# Altium project bch-stmnode_v0.2.PrjPcb (part 1 of 2)
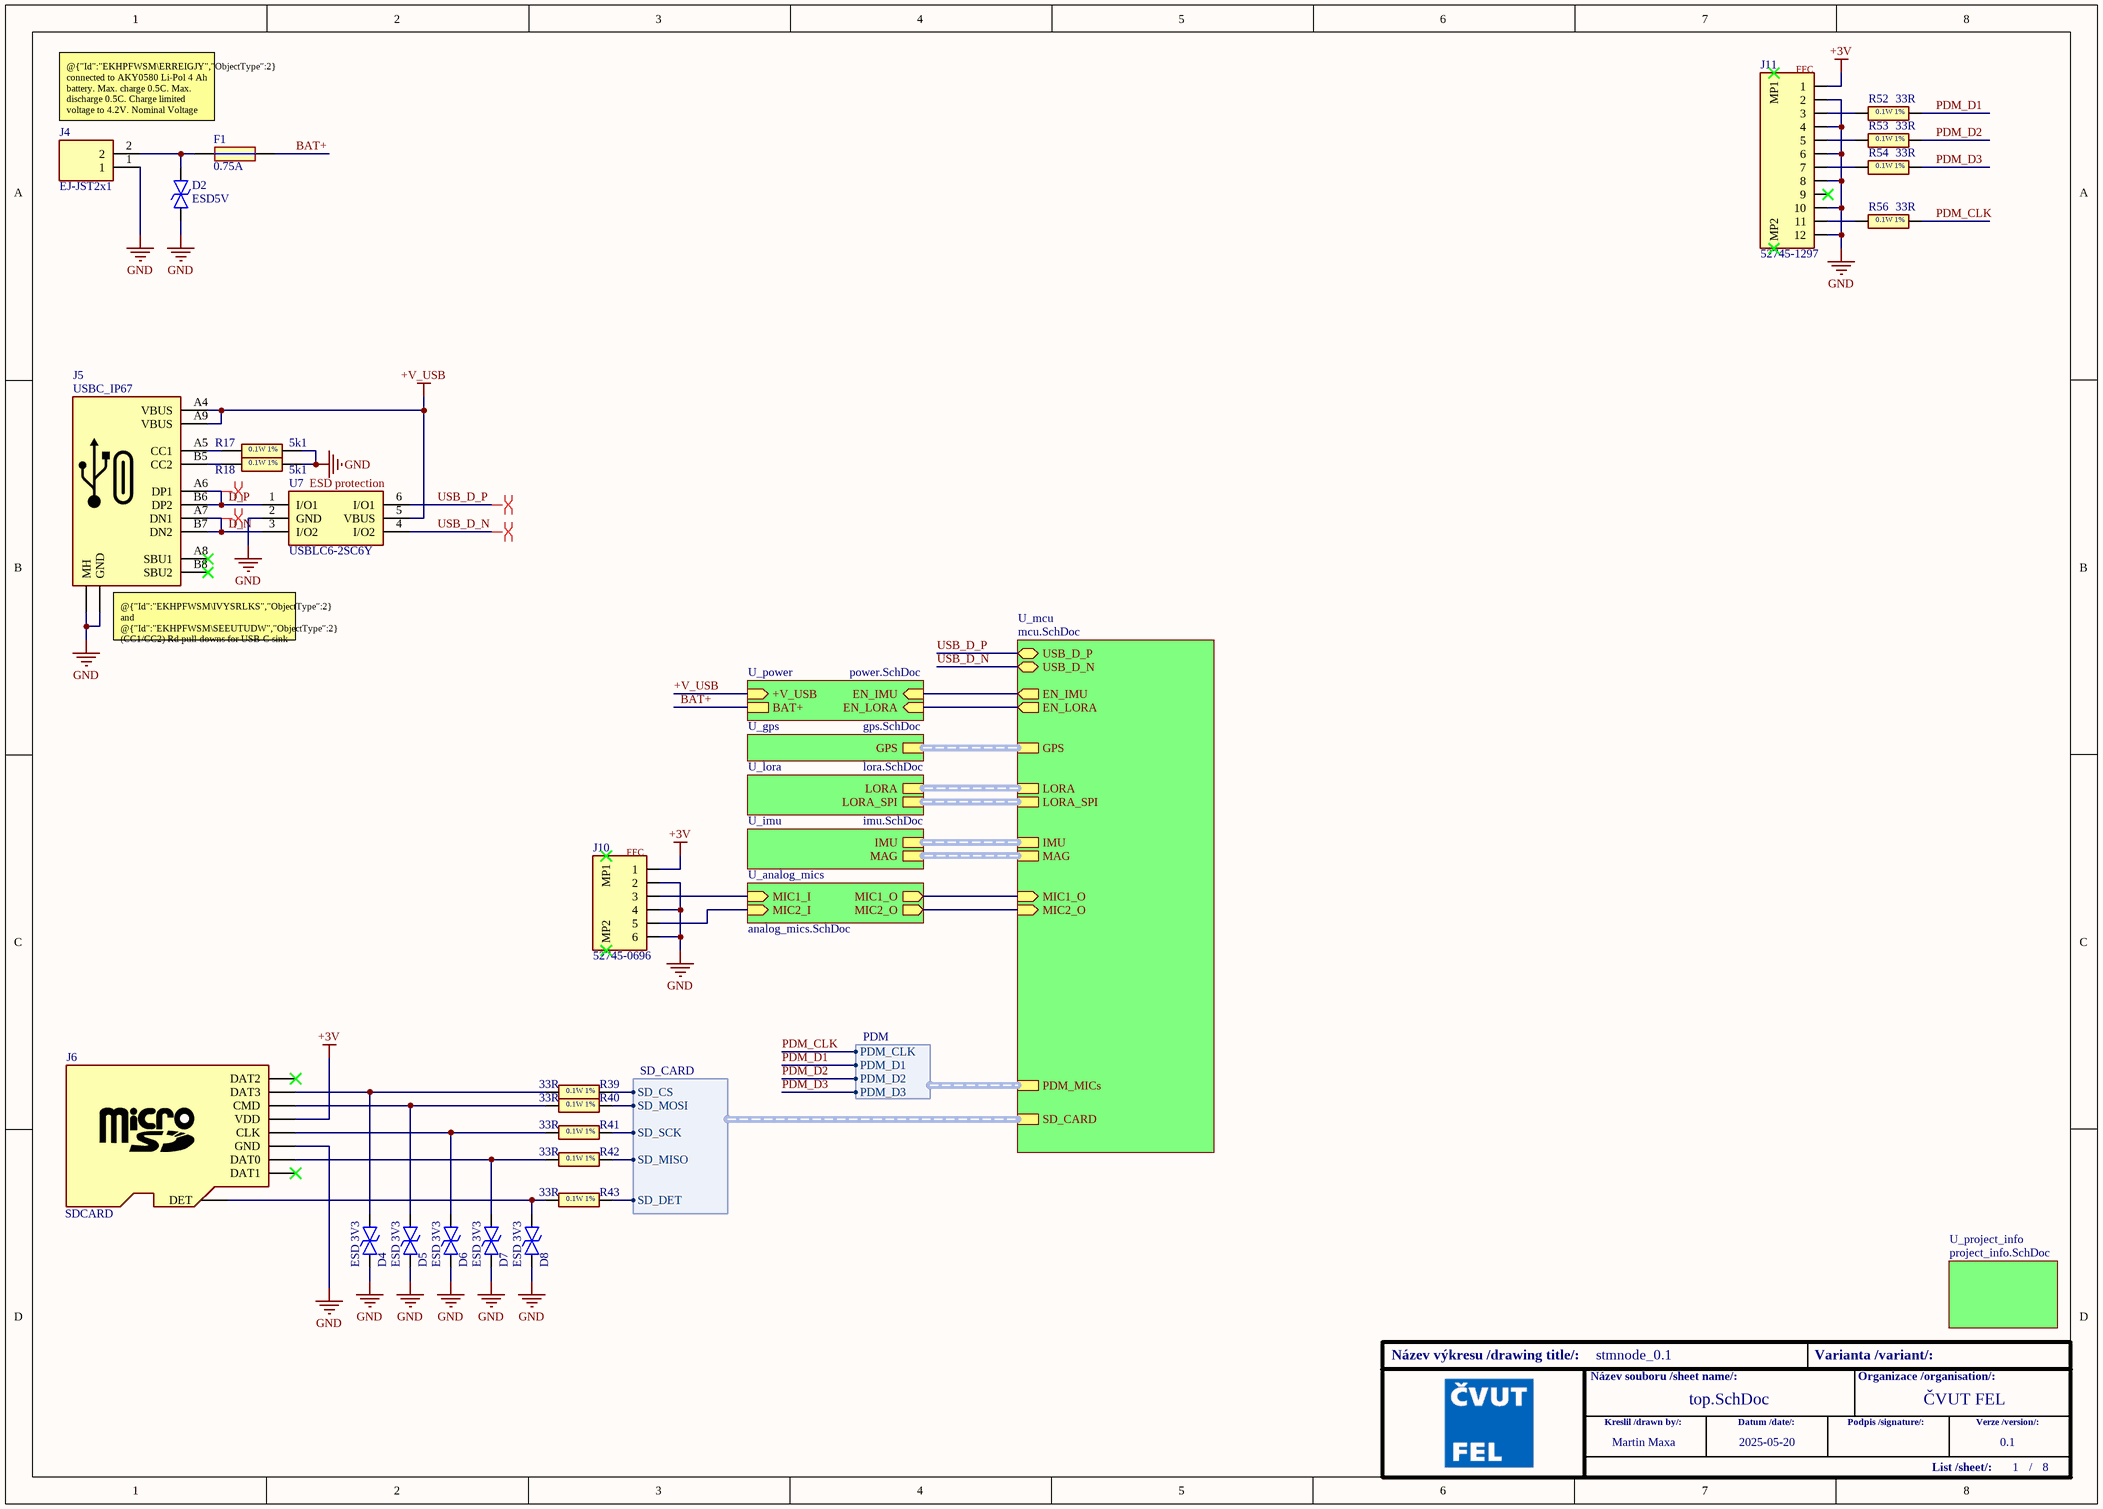
[diagram p0: top.SchDoc]
Author: Martin Maxa; Date: 2025-05-20; Name: stmnode; Project: boomchecker; Revision: 0.1
7 sheets, 140 parts. Net scope: hierarchical (ports join the sheet entries above them; power ports are global).
Board file: bch-stmnode_v0.2.PcbDoc
Sheets:
  top.SchDoc
    U_gps = gps.SchDoc
    U_lora = lora.SchDoc
    U_power = power.SchDoc
    U_mcu = mcu.SchDoc
    U_imu = imu.SchDoc
    U_project_info = project_info.SchDoc

## Sheet top.SchDoc
size A3; SheetNumber: 1; SheetTotal: 8

### Parts
D2  ESD5V  [SODFL1006X40N]
D4  ESD 3V3  [SODFL1006X40N]
D5  ESD 3V3  [SODFL1006X40N]
D6  ESD 3V3  [SODFL1006X40N]
D7  ESD 3V3  [SODFL1006X40N]
D8  ESD 3V3  [SODFL1006X40N]
F1  0.75A  [PTS120630V012]
J4  EJ-JST2x1  [S2BZRLFSN]
J5  USBC_IP67  [USB472003A]
J6  SDCARD  [1051620001]
J10  52745-0696  [527450696]
J11  52745-1297  [527451297]
R17  5k1  [RESC1608X55N]
R18  5k1  [RESC1608X55N]
R39  33R  [RESC1608X55N]
R40  33R  [RESC1608X55N]
R41  33R  [RESC1608X55N]
R42  33R  [RESC1608X55N]
R43  33R  [RESC1608X55N]
R52  33R  [RESC1608X55N]
R53  33R  [RESC1608X55N]
R54  33R  [RESC1608X55N]
R56  33R  [RESC1608X55N]
U7  USBLC6-2SC6Y  [SOT95P280X145-6N]

### Sub-sheets
U_analog_mics = analog_mics.SchDoc (file not in this document): MIC1_I (in), MIC2_I (in), MIC1_O (out), MIC2_O (out)
U_gps = gps.SchDoc: GPS (harness GPS)
U_imu = imu.SchDoc: MAG (harness MAG), IMU (harness IMU)
U_lora = lora.SchDoc: LORA_SPI (harness SPI), LORA (harness EBYTE22)
U_mcu = mcu.SchDoc: SD_CARD (harness SD_CARD), PDM_MICs (harness PDM), USB_D_P (bidir), USB_D_N (bidir), EN_IMU (out), EN_LORA (out), GPS (harness GPS), LORA (harness EBYTE22), LORA_SPI (harness SPI), IMU (harness IMU), MAG (harness MAG), MIC1_O (in), MIC2_O (in)
U_power = power.SchDoc: BAT+, EN_LORA (in), EN_IMU (in), +V_USB (in)
U_project_info = project_info.SchDoc: no entries

### Harnesses
SD_CARD: SD_CS, SD_MOSI, SD_SCK, SD_MISO, SD_DET
PDM: PDM_D3, PDM_D2, PDM_D1, PDM_CLK

### Nets
+3V: J6.4(VDD) J10.1 J11.1
+V_USB: J5.A4(VBUS) J5.A9(VBUS) U7.5(VBUS) ; sheet U_power/+V_USB
GND: D2.1 D4.1 D5.1 D6.1 D7.1 D8.1 J4.1 J5.A12(GND) J5.MH1(MH) J6.10(GND) J10.2 J10.4 J10.6 J11.2 J11.4 J11.6 J11.8 J11.10 J11.12 R17.2 R18.2 U7.2(GND)
BAT+: F1.2 ; sheet U_power/BAT+
D_N: J5.A7(DN1) J5.B7(DN2) U7.3(I/O2)  [project net D_N_1]
D_P: J5.A6(DP1) J5.B6(DP2) U7.1(I/O1)  [project net D_P_1]
PDM_CLK: R56.2 ; sheet U_mcu/PDM_MICs.PDM_CLK
PDM_D1: R52.2 ; sheet U_mcu/PDM_MICs.PDM_D1
PDM_D2: R53.2 ; sheet U_mcu/PDM_MICs.PDM_D2
PDM_D3: R54.2 ; sheet U_mcu/PDM_MICs.PDM_D3
SD_CS: R39.2 ; sheet U_mcu/SD_CARD.SD_CS
SD_DET: R43.2 ; sheet U_mcu/SD_CARD.SD_DET
SD_MISO: R42.2 ; sheet U_mcu/SD_CARD.SD_MISO
SD_MOSI: R40.2 ; sheet U_mcu/SD_CARD.SD_MOSI
SD_SCK: R41.2 ; sheet U_mcu/SD_CARD.SD_SCK
USB_D_N: U7.4(I/O2) ; sheet U_mcu/USB_D_N
USB_D_P: U7.6(I/O1) ; sheet U_mcu/USB_D_P
NetD2_2: D2.2 F1.1 J4.2
NetD4_2: D4.2 J6.2(DAT3) R39.1
NetD5_2: D5.2 J6.3(CMD) R40.1
NetD6_2: D6.2 J6.5(CLK) R41.1
NetD7_2: D7.2 J6.7(DAT0) R42.1
NetD8_2: D8.2 J6.9(DET) R43.1
NetJ5_A5: J5.A5(CC1) R17.1
NetJ5_B5: J5.B5(CC2) R18.1
NetJ10_3: J10.3 ; sheet U_analog_mics/MIC1_I
NetJ10_5: J10.5 ; sheet U_analog_mics/MIC2_I
NetJ11_3: J11.3 R52.1
NetJ11_5: J11.5 R53.1
NetJ11_7: J11.7 R54.1
NetJ11_11: J11.11 R56.1
NetU4_34: sheet U_mcu/MIC1_O, sheet U_analog_mics/MIC1_O
NetU4_35: sheet U_mcu/MIC2_O, sheet U_analog_mics/MIC2_O
NetU4_58: sheet U_power/EN_LORA, sheet U_mcu/EN_LORA
NetU4_128: sheet U_power/EN_IMU, sheet U_mcu/EN_IMU

Not connected (* = marked no-connect by the designer): J5 A8(SBU1)* B8(SBU2)*; J6 1(DAT2)* 8(DAT1)*; J10 7(MP1)* 8(MP2)*; J11 9* MP1* MP2*

### Buses and harness runs
harness sheet U_gps/GPS = sheet U_mcu/GPS
harness sheet U_imu/IMU = sheet U_mcu/IMU
harness sheet U_imu/MAG = sheet U_mcu/MAG
harness sheet U_lora/LORA = sheet U_mcu/LORA
harness sheet U_lora/LORA_SPI = sheet U_mcu/LORA_SPI

### Layout directives
differential pair; differential pair class USB: D_N_1, D_P_1, USB_D_N, USB_D_P

### Notes on the sheet
- (near J11) FFC
- @{"Id":"EKHPFWSM\ERREIGJY","ObjectType":2} connected to AKY0580 Li-Pol 4 Ah battery. Max. charge 0.5C. Max. discharge 0.5C. Charge limited voltage to 4.2V. Nominal Voltage 3.7V.
- (near U7) ESD protection
- (near J5) @{"Id":"EKHPFWSM\IVYSRLKS","ObjectType":2} and @{"Id":"EKHPFWSM\SEEUTUDW","ObjectType":2} (CC1/CC2) Rd pull-downs for USB-C sink detection. USB2.0 = 500mA; USB3.x = 900mA.
- (near J10) FFC
- Název výkresu /drawing title/:
- Název souboru /sheet name/:
- Varianta /variant/:
- Organizace /organisation/:
- ČVUT FEL
- Kreslil /drawn by/:
- Datum /date/:
- Podpis /signature/:
- List /sheet/:
- Verze /version/:
- /
- (in symbol ER+5k1) 0.1W 1%
- (in symbol ER+33R) 0.1W 1%

### Library data of the parts
D2 = ED+ESD5V: ESD Protection Diode, Bidirectional, VRWM=5 V, VBR=6 V typ., VC=14 V max, IPP=6 A, Cd=20 pF, ±30 kV ESD, SOD-923; Manufacturer_Name: Diodes Incorporated; Manufacturer_Part_Number: D5V0L1B2S9-7; Datasheet Link: https://www.diodes.com/assets/Datasheets/D5V0L1B2S9.pdf; Height: 0.4mm; Mouser Part Number: 621-D5V0L1B2S9-7; Mouser Price/Stock: https://www.mouser.co.uk/ProductDetail/Diodes-Incorporated/D5V0L1B2S9-7?qs=bLNvM6dkO6SRwc%2Fzm27P2g%3D%3D; Arrow Part Number: D5V0L1B2S9-7; Arrow Price/Stock: https://www.arrow.com/en/products/d5v0l1b2s9-7/diodes-incorporated?utm_currency=USD&region=nac
D4-D8 = ED+ESD3.3V15pF: Vesd (ESD contact/air gap): 18 kV, Cd (Diode Capacitance): 15 pF, Working Voltage: 3.3 V, Breakdown Voltage: 5 V, Clamping Voltage: 10.5 V; Manufacturer_Name: onsemi; Manufacturer_Part_Number: ESD9B3.3ST5G; Datasheet Link: https://www.onsemi.com/pub/Collateral/ESD9B-D.PDF; Height: 0.4mm; Mouser Part Number: 863-ESD9B3.3ST5G; Mouser Price/Stock: https://www.mouser.co.uk/ProductDetail/onsemi/ESD9B3.3ST5G?qs=yU2N9dt%252BrfmXrPf3vhgUEA%3D%3D; Arrow Part Number: ESD9B3.3ST5G; Arrow Price/Stock: https://www.arrow.com/en/products/esd9b3.3st5g/on-semiconductor?utm_currency=USD&region=nac
F1 = EF+0.75A6V_1206: Resettable Fuses - PPTC 1206 6V 0.75A 1.1W SMD AEC-Q200 High Temp; Manufacturer_Name: YAGEO; Manufacturer_Part_Number: SMDH1206B075TF; Datasheet Link: https://cz.mouser.com/datasheet/3/508/1/smdh1206.pdf; Mouser Part Number: 603-SMDH1206B075TF; Mouser Price/Stock: https://cz.mouser.com/ProductDetail/YAGEO/SMDH1206B075TF?qs=jcD%2FCkGBYeN0SVo4GFcQbQ%3D%3D
J4 = EJ-JST2x1: Konektor: kabel-pl.spoj; zásuvka; vidlice; PIN: 2; PH; 2A; 100V; SMT; Manufacturer_Name: JST (JAPAN SOLDERLESS TERMINALS); Manufacturer_Part_Number: S2B-ZR (LF)(SN); Datasheet Link: https://www.jst-mfg.com/product/pdf/eng/eZH.pdf?6794690f4fd86; Height: 3.7mm; Arrow Part Number: S2B-ZR (LF)(SN); Arrow Price/Stock: https://www.arrow.com/en/products/s2b-zr-lf-sn/jst-manufacturing?region=europe
J5 = EJ-USBC_IP67: USB Connectors USB2.0 TypeC Recpt., 3u Gold, 16P Horz Mid Mount SMT, 1.13mm O-set, IP67; pin to pad: A1, A12>A12+A1 A12>A12+A1 MH>MH1+MH2+MH3+MH4+MH5+MH6; Manufacturer_Name: GCT (GLOBAL CONNECTOR TECHNOLOGY); Manufacturer_Part_Number: USB4720-03-A; Datasheet Link: https://www.gct.co/files/drawings/USB4720.pdf; Height: 3.9mm; Mouser Part Number: 640-USB472003A; Mouser Price/Stock: https://www.mouser.co.uk/ProductDetail/GCT/USB4720-03-A?qs=Z%252BL2brAPG1IK%252BbxHmYg8zQ%3D%3D
J6 = EMECH+SDCARD: Memory Card Connectors Micro SD Push Pull SMT 1.15mm; pin to pad: 10>6+10+11+12+13; Manufacturer_Name: Molex; Manufacturer_Part_Number: 105162-0001; Datasheet Link: http://www.molex.com/webdocs/datasheets/pdf/en-us//1051620001_MEMORY_CARD_SOCKET.pdf; Height: 1.45mm; Mouser Part Number: 538-105162-0001; Mouser Price/Stock: https://www.mouser.co.uk/ProductDetail/Molex/105162-0001?qs=1fNsfHe5VsK8daqlgKxZfQ%3D%3D
J10 = EJ+52745-0696: FFC & FPC Connectors RA SMT ZIF TOP 6P ROHS COMPLIANT, Pitch: 0.5 mm, Mounting Angle / Contact Location: Right Angle / Top Contact, Current Rating: 500 mA, Voltage Rating: 50 V; Manufacturer_Name: Molex; Datasheet Link: https://www.molex.com/content/dam/molex/molex-dot-com/products/automated/en-us/salesdrawingpdf/527/52745/527450696_sd.pdf?inline; Height: 2.2mm; Manufacturer_Part_Number: 52745-0696; Mouser Part Number: 538-52745-0696; Mouser Price/Stock: https://www.mouser.co.uk/ProductDetail/Molex/52745-0696?qs=AU9XQWArEY9ei7I32bfdLw%3D%3D
J11 = EJ+52745-1297: FFC & FPC Connectors RA SMT ZIF TOP 12P GOLD, Pitch: 0.5 mm, Mounting Angle / Contact Location: Right Angle / Top Contact, Current Rating: 500 mA, Voltage Rating: 50 V; Manufacturer_Name: Molex; Datasheet Link: https://www.molex.com/pdm_docs/sd/527451297_sd.pdf; Height: 2mm; Manufacturer_Part_Number: 52745-1297; Mouser Part Number: 538-52745-1297; Mouser Price/Stock: https://www.mouser.co.uk/ProductDetail/Molex/52745-1297?qs=nDwhpid8gJaCgIkitRUygg%3D%3D
R17 R18 = ER+5k1: Thick Film Resistors - SMD 1/10Watt 5.1Kohms 1%; Manufacturer_Name: Vishay; Manufacturer_Part_Number: CRCW06035K10FKEBC; Datasheet Link: https://www.vishay.com/docs/28773/crcwce3.pdf; Height: 0.55mm; Mouser Part Number: 71-CRCW06035K10FKEBC; Mouser Price/Stock: https://www.mouser.co.uk/ProductDetail/Vishay-Dale/CRCW06035K10FKEBC?qs=wd5RIQLrsJiajonkePuzqw%3D%3D; Arrow Part Number: CRCW06035K10FKEBC; Arrow Price/Stock: https://www.arrow.com/en/products/crcw06035k10fkebc/vishay?region=nac
R39-R43 R52-R54 R56 = ER+33R: Resistor 1% 0.1W; Manufacturer_Name: ROYALOHM; Manufacturer_Part_Number: 0603WAF330JT5E; Datasheet Link: https://datasheet.lcsc.com/lcsc/2206010116_UNI-ROYAL-Uniroyal-Elec-0603WAF330JT5E_C23140.pdf; Height: 0.55mm; Mouser Part Number: 303-0603WAF330JT5E; Mouser Price/Stock: https://www.mouser.co.uk/ProductDetail/Royalohm/0603WAF330JT5E?qs=e8oIoAS2J1RitKiKgULsBA%3D%3D
U7 = EU+ESDUSBLC6: Low Cap. ESD Protection Auto SOT-23-6 STMicroelectronics USBLC6-2SC6Y, Dual Uni-Directional TVS Diode Array, 6-Pin SOT-23; Geometry.Height: 1.45mm; Manufacturer_Name: STMicroelectronics; Manufacturer_Part_Number: USBLC6-2SC6Y; Mouser Part Number: 511-USBLC6-2SC6Y; Mouser Price/Stock: https://www.mouser.co.uk/ProductDetail/STMicroelectronics/USBLC6-2SC6Y?qs=gNDSiZmRJS%2FOgDexvXkdow%3D%3D; Arrow Part Number: USBLC6-2SC6Y; Arrow Price/Stock: https://www.arrow.com/en/products/usblc6-2sc6y/stmicroelectronics.html?utm_currency=USD&region=nac; Datasheet Link: https://www.st.com/resource/en/datasheet/usblc6-2sc6y.pdf

## Sheet gps.SchDoc
size A4; SheetNumber: 2; SheetTotal: 6
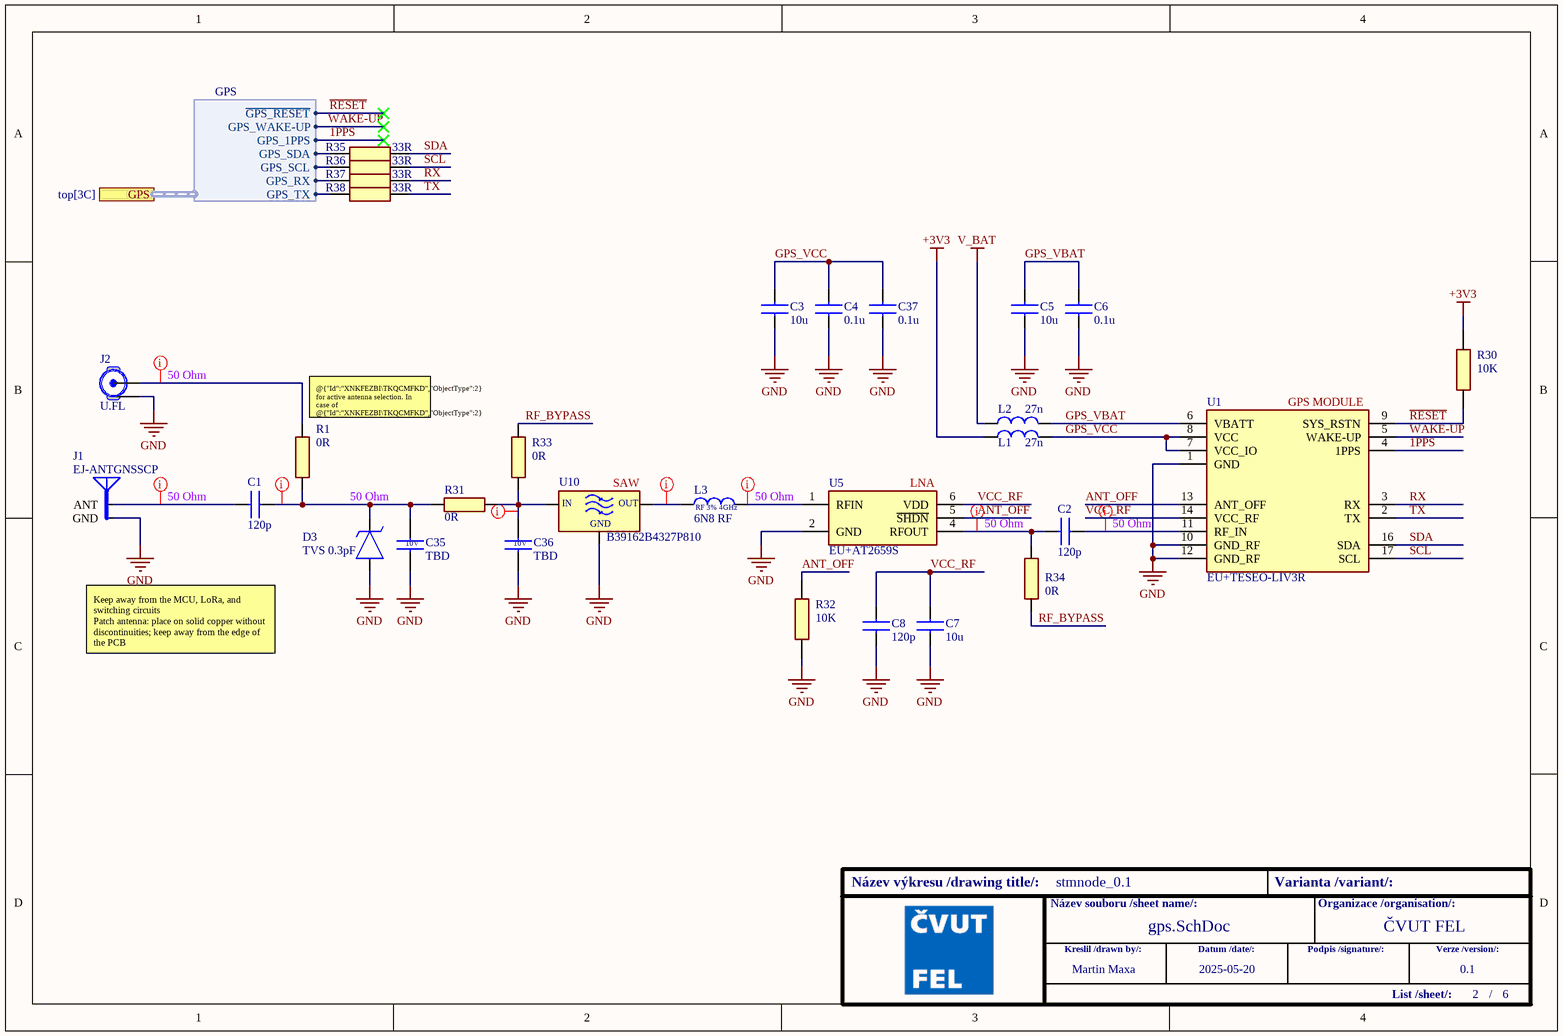
[diagram p1: gps.SchDoc]

### Parts
(Parts that share a designator on the sheet are numbered #1, #2 ... from top to bottom, then left to right.)
C1  120p  [CAPC1005X55N]
C2  120p  [CAPC1005X55N]
C3  10u  [C0603]
C4  0.1u  [CAPC1608X95N]
C5#1  10u  [C0603]
C6  0.1u  [CAPC1608X95N]
C7  10u  [C0603]
C8  120p  [CAPC1005X55N]
C35  TBD  [CAPC1608X97N]
C36  TBD  [CAPC1608X97N]
C37#1  0.1u  [CAPC1608X95N]
D3  TVS 0.3pF  [SP320501ETG]
J1  EJ-ANTGNSSCP  [ANTGNSSCPTH18L1]
J2  U.FL  [CONUFL001SMDT]
L1  27n  [LQG15WH0N7B02D]
L2  27n  [LQG15WH0N7B02D]
L3  6N8 RF  [LQW15CNR20J00B]
R1  0R  [RESC1005X37N]
R30  10K  [RESC1608X50N]
R31  0R  [RESC1005X37N]
R32  10K  [RESC1608X50N]
R33  0R  [RESC1005X37N]
R34  0R  [RESC1005X37N]
R35  33R  [RESC1608X55N]
R36  33R  [RESC1608X55N]
R37  33R  [RESC1608X55N]
R38  33R  [RESC1608X55N]
U1  EU+TESEO-LIV3R  [TESEOLIV3R]
U5  EU+AT2659S  [SOT95P280X125-6N]
U10  B39162B4327P810  [B39162B4327P810]

### Ports
GPS (harness GPS, see top[3C])

### Harnesses
GPS: GPS_TX, GPS_RX, GPS_SCL, GPS_SDA, GPS_1PPS, GPS_WAKE-UP, ~{GPS_RESET}

### Nets
+3V3: L1.23 R30.2
GND: C3.1 C4.1 C5#1.1 C6.1 C7.1 C8.1 C35.2 C36.2 C37#1.1 D3.2(A) J1.2(GND) J2.2(GND) R32.1 U1.1(GND) U1.10(GND_RF) U1.12(GND_RF) U5.2(GND) U10.2
V_BAT: L2.23
1PPS: U1.4(1PPS) ; port GPS.GPS_1PPS
ANT_OFF: R32.2 U1.13(ANT_OFF) U5.5(~{SHDN})  [project net ANT_OFF_2]
GPS_RX: R37.1 ; port GPS.GPS_RX
GPS_SCL: R36.1 ; port GPS.GPS_SCL
GPS_SDA: R35.1 ; port GPS.GPS_SDA
GPS_TX: R38.1 ; port GPS.GPS_TX
GPS_VBAT: C5#1.2 C6.2 L2.24 U1.6(VBATT)  [project net GPS_VBAT_2]
GPS_VCC: C3.2 C4.2 C37#1.2 L1.24 U1.7(VCC_IO) U1.8(VCC)  [project net GPS_VCC_2]
~{RESET}: R30.1 U1.9(SYS_RSTN) ; port GPS.~{GPS_RESET}  [project net ~{GPS_RESET}]
RF_BYPASS: R33.2 R34.1  [project net RF_BYPASS_2]
RX: R37.2 U1.3(RX)  [project net RX_2]
SCL: R36.2 U1.17(SCL)  [project net SCL_2]
SDA: R35.2 U1.16(SDA)  [project net SDA_2]
TX: R38.2 U1.2(TX)  [project net TX_2]
VCC_RF: C7.2 C8.2 U1.14(VCC_RF) U5.6(VDD)  [project net VCC_RF_2]
WAKE-UP: U1.5(WAKE-UP) ; port GPS.GPS_WAKE-UP  [project net GPS_WAKE-UP]
NetC1_1: C1.1 J1.1(ANT)
NetC1_2: C1.2 C35.1 D3.1(K) R1.1 R31.1
NetC2_1: C2.1 R34.2 U5.4(RFOUT)
NetC2_2: C2.2 U1.11(RF_IN)
NetC36_1: C36.1 R31.2 R33.1 U10.1(IN)
NetJ2_1: J2.1(SIG) R1.2
NetL3_23: L3.23 U10.4(OUT)
NetL3_24: L3.24 U5.1(RFIN)

### Layout directives
net class 50R_RF: NetC1_1, NetC1_2, NetC2_1, NetC2_2, NetC36_1, NetJ2_1, NetL3_23, NetL3_24

### Notes on the sheet
- 50 Ohm
- (near R1) @{"Id":"XNKFEZBI\TKQCMFKD","ObjectType":2} for active antenna selection. In case of @{"Id":"XNKFEZBI\TKQCMFKD","ObjectType":2} placed leave @{"Id":"XNKFEZBI\TFZHEKEL","ObjectType":2} unpopulated.
- (near U1) GPS MODULE
- (near U10) SAW
- (near L3) 50 Ohm
- (near U5) LNA
- Keep away from the MCU, LoRa, and switching circuits
  Patch antenna: place on solid copper without discontinuities; keep away from the edge of the PCB
- Název výkresu /drawing title/:
- Název souboru /sheet name/:
- Varianta /variant/:
- Organizace /organisation/:
- ČVUT FEL
- Kreslil /drawn by/:
- Datum /date/:
- Podpis /signature/:
- List /sheet/:
- Verze /version/:
- /
- (in symbol ECK+12p10V) 10V
- (in symbol EL+6N8RF_0402) RF 3% 4GHz
- (in symbol EU+GNSSSAW) GND
- (in symbol ECK+10u10V) 10V
- (in symbol ECK+100n16V) 16V
- (in symbol ER+10K) 0.1W 1%

### Library data of the parts
C1 C2 C8 = ECK+120p_50V_0402: Multilayer Ceramic Capacitors MLCC - SMD/SMT 120 pF 50 VDC 5% 0402 C0G (NP0) AEC-Q200; Manufacturer_Name: Murata Electronics; Manufacturer_Part_Number: GCM1555C1H121JA16J; Datasheet Link: https://search.murata.co.jp/Ceramy/image/img/A01X/G101/ENG/GCM1555C1H121JA16-01A.pdf; Height: 0.55mm; Mouser Part Number: 81-GCM1555C1H121JA6J; Mouser Price/Stock: https://www.mouser.co.uk/ProductDetail/Murata-Electronics/GCM1555C1H121JA16J?qs=bGEzvQhTDnbTpDR%252B7iTnIA%3D%3D; Arrow Part Number: GCM1555C1H121JA16J; Arrow Price/Stock: https://www.arrow.com/en/products/gcm1555c1h121ja16j/murata-manufacturing?region=nac
C3 C5#1 C7 = ECK+10u10V: 10 VDC, 20 %, X5R; Manufacturer_Name: KEMET; Manufacturer_Part_Number: C0603C106M8PACTU; Datasheet Link: https://content.kemet.com/datasheets/KEM_C1006_X5R_SMD.pdf; Height: 0.87mm; Mouser Part Number: 80-C0603C106M8PACTU; Mouser Price/Stock: https://www.mouser.co.uk/ProductDetail/KEMET/C0603C106M8PACTU?qs=gt1LBUVyoHk6B7S%252BOYJa0A%3D%3D; Arrow Part Number: C0603C106M8PACTU; Arrow Price/Stock: https://www.arrow.com/en/products/c0603c106m8pactu/kemet-corporation?region=nac
C4 C6 C37#1 = ECK+100n16V: 16V 0.1uF XR7 0603 10%; Manufacturer_Name: KEMET; Manufacturer_Part_Number: C0603C104K4RAC-TU; Datasheet Link: https://connect.kemet.com:7667/gateway/IntelliData-ComponentDocumentation/1.0/download/specsheet/C0603C104K4RACTU; Height: 0.95mm; Mouser Part Number: 80-C0603C104K4RAC; Arrow Part Number: C0603C104K4RAC-TU; Arrow Price/Stock: https://www.arrow.com/en/products/c0603c104k4ractu/kemet-corporation
C35 C36 = ECK+12p10V: Multilayer Ceramic Capacitors MLCC - SMD/SMT 0603 12pF 10volts C0G(N0P) 1%; Manufacturer_Name: Vishay; Manufacturer_Part_Number: VJ0603A120FXQCW1BC; Datasheet Link: https://www.vishay.com/docs/45199/vjcommercialseries.pdf; Height: 0.97mm; Mouser Part Number: 77-VJ0603A120FXQCBC; Mouser Price/Stock: https://www.mouser.com/Search/Refine.aspx?Keyword=77-VJ0603A120FXQCBC; Arrow Part Number: VJ0603A120FXQCW1BC; Arrow Price/Stock: https://www.arrow.com/en/products/vj0603a120fxqcw1bc/vishay
D3 = ED+TVSSP3205_3V3_0.3pF: ESD Protection Diodes / TVS Diodes ESD 3.3V UNI, Working Voltage: 3.3 V, Clamping Voltage: 12 V, Breakdown Voltage: 3.6 V, Ipp - Peak Pulse Current: 4 A , Cd - Diode Capacitance: 0.3 pF; Manufacturer_Name: LITTELFUSE; Manufacturer_Part_Number: SP3205-01ETG; Datasheet Link: https://4donline.ihs.com/images/VipMasterIC/IC/LFSI/LFSI-S-A0010724013/LFSI-S-A0010724013-1.pdf?hkey=6D3A4C79FDBF58556ACFDE234799DDF0; Height: 0.55mm; Mouser Part Number: 576-SP3205-01ETG; Mouser Price/Stock: https://www.mouser.co.uk/ProductDetail/Littelfuse/SP3205-01ETG?qs=vHuUswq2%252BswfNhVD4WkB%252BQ%3D%3D; Arrow Part Number: SP3205-01ETG; Arrow Price/Stock: https://www.arrow.com/en/products/sp3205-01etg/littelfuse?utm_currency=USD&region=nac
J1 = EJ-ANTGNSSCP: Antennas ANTENNA GNSS L1 18X18 THM; pin to pad: 2>2+3+4+5 2,3,4,5>2+3+4+5; Manufacturer_Name: Linx; Manufacturer_Part_Number: ANT-GNSSCP-TH18L1; Datasheet Link: https://www.te.com/commerce/DocumentDelivery/DDEController?Action=srchrtrv&DocNm=C-ANT-GNSSCP-TH18L1&DocType=Customer%20Drawing&DocLang=English&DocFormat=pdf&PartCntxt=ANT-GNSSCP-TH18L1; Height: 4mm
J2 = EJ+U.FL: RF Connectors / Coaxial Connectors T&R U.FL Straight Surface Mount Jack 6 GHz 50 Ohms; pin to pad: 2>2+3; Manufacturer_Name: TE Connectivity; Manufacturer_Part_Number: CONUFL001-SMD-T; Datasheet Link: https://eu.mouser.com/datasheet/2/418/9/ENG_DS_CONUFL001_SMD_T_B-3238717.pdf; Height: 1.3mm; Mouser Part Number: N/A; Mouser Price/Stock: https://www.mouser.co.uk/ProductDetail/TE-Connectivity/CONUFL001-SMD-T?qs=3Rah4i%252BhyCHmRzMH%252BkLkPQ%3D%3D; Arrow Part Number: CONUFL001-SMD-T; Arrow Price/Stock: https://www.arrow.com/en/products/conufl001-smd-t/te-connectivity?utm_currency=USD&region=nac
L1 L2 = EL+27n_0402: LQG15HS27NJ02D RF Inductors - SMD 27 NH 5%; Datasheet Link: https://cz.mouser.com/datasheet/3/76/2/JELF243B_0010.pdf; Manufacturer_Name: LQG15HS27NJ02D; Manufacturer_Part_Number: LQG15HS27NJ02D; Mouser Part Number: 81-LQG15HS27NJ02D; Mouser Price/Stock: https://mou.sr/4wJB6bA
L3 = EL+6N8RF_0402: RF Inductor
R1 R31 R33 R34 = ER+0R_0402: Thick Film Resistors - SMD 0 Ohms 1/16 W 50 V 1% 0402 - 55 C + 155 C AEC-Q200; Manufacturer_Name: Yageo Group; Manufacturer_Part_Number: AC0402FR-070RL; Datasheet Link: https://www.yageo.com/upload/media/product/productsearch/datasheet/rchip/PYu-AC_51_RoHS_L_11.pdf; Height: 0.37mm; Mouser Part Number: 603-AC0402FR-070RL; Mouser Price/Stock: https://www.mouser.co.uk/ProductDetail/YAGEO/AC0402FR-070RL?qs=ygRr%2FtkhtettkzGxq5kFaA%3D%3D; Arrow Part Number: AC0402FR-070RL; Arrow Price/Stock: https://www.arrow.com/en/products/ac0402fr-070rl/yageo?region=nac
R30 R32 = ER+10K: Resistor 1%, 0.1W; Manufacturer_Name: Vishay; Manufacturer_Part_Number: CRCW060310K0FKEA; Datasheet Link: http://www.vishay.com/docs/20035/dcrcwe3.pdf; Height: 0.5mm; Mouser Part Number: 71-CRCW0603-10K-E3; Mouser Price/Stock: https://www.mouser.co.uk/ProductDetail/Vishay-Dale/CRCW060310K0FKEA?qs=pAO1Z172M84BVnhDjtnsoQ%3D%3D; Arrow Part Number: CRCW060310K0FKEA; Arrow Price/Stock: https://www.arrow.com/en/products/crcw060310k0fkea/vishay?region=europe
R35-R38 = ER+33R: Resistor 0603 1/10W 1%; Manufacturer_Name: ROYALOHM; Manufacturer_Part_Number: 0603WAF330JT5E; Datasheet Link: https://datasheet.lcsc.com/lcsc/2206010116_UNI-ROYAL-Uniroyal-Elec-0603WAF330JT5E_C23140.pdf; Height: 0.55mm; Mouser Part Number: 303-0603WAF330JT5E; Mouser Price/Stock: https://www.mouser.co.uk/ProductDetail/Royalohm/0603WAF330JT5E?qs=e8oIoAS2J1RitKiKgULsBA%3D%3D
U1 = EU+TESEO-LIV3R: Tiny ROM GNSS module; Manufacturer_Name: STMicroelectronics; Datasheet Link: https://www.st.com/resource/en/datasheet/teseo-liv3r.pdf; Height: 2.3mm; Manufacturer_Part_Number: TESEO-LIV3R; Mouser Part Number: 511-TESEO-LIV3R; Mouser Price/Stock: https://www.mouser.co.uk/ProductDetail/STMicroelectronics/TESEO-LIV3R?qs=ZSypp649SOXG7EmhCFcBlw%3D%3D; Arrow Part Number: TESEO-LIV3R; Arrow Price/Stock: https://www.arrow.com/en/products/teseo-liv3r/stmicroelectronics?utm_currency=USD&region=nac
U5 = EU+AT2659S: 1.55GHz~1.615GHz 21.5dB 1.4V~3.6V 0.8dB -14dBm 4.3mA DFN-6(1x1.6) RF Amplifiers RoHS; pin to pad: 2>2+3; Manufacturer_Name: Hangzhou ZhongKe Microelectronics; Datasheet Link: http://lanzhi-tech.com/filedownload/89817; Height: 1.25mm; Manufacturer_Part_Number: AT2659S
U10 = EU+GNSSSAW: Signal Conditioning - 40 C to + 85 C 1.5824 GHz 1 dB 2 MHz, 4.092 MHz, 8.34 MHz 50 Ohms GNSS; pin to pad: 2>2+3+5; Manufacturer_Name: RF360; Datasheet Link: https://mm.digikey.com/Volume0/opasdata/d220001/medias/docus/992/B39162B4327P810_Rev2.2.pdf; Height: 0.45mm; Manufacturer_Part_Number: B39162B4327P810; Mouser Part Number: 871-B39162B4327P810; Mouser Price/Stock: https://www.mouser.co.uk/ProductDetail/RF360/B39162B4327P810?qs=lGUynpphgXxwtn5A8O%2FIyg%3D%3D; Arrow Part Number: B39162B4327P810; Arrow Price/Stock: https://www.arrow.com/en/products/b39162b4327p810/qualcomm-rf360-a-qualcomm-tdk-joint-venture?region=nac

## Sheet lora.SchDoc
size A4; SheetNumber: 4; SheetTotal: 7
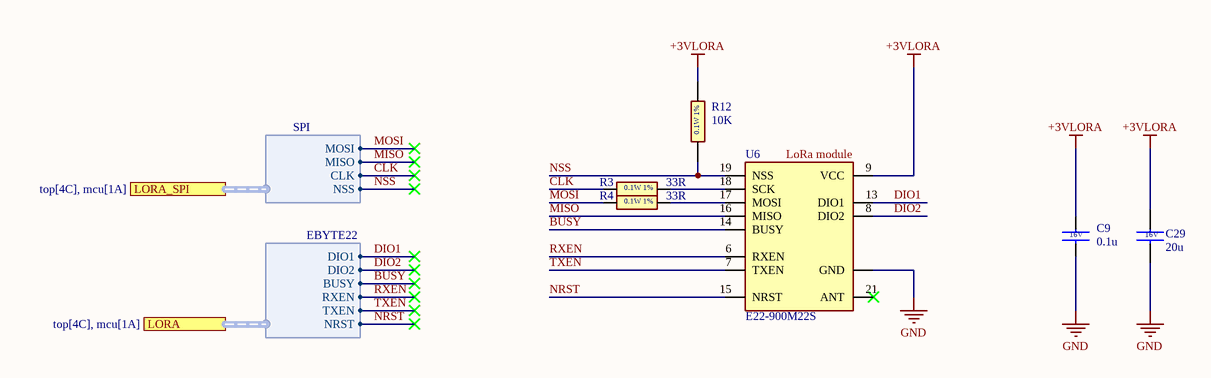
[diagram p2: lora.SchDoc]

### Parts
C9  0.1u  [CAPC1608X95N]
C29  20u  [C0603]
R3  33R  [RESC1608X55N]
R4  33R  [RESC1608X55N]
R12  10K  [RESC1608X50N]
U6  E22-900M22S  [E22-900M22S]

### Ports
LORA (harness EBYTE22, see top[4C], mcu[1A]), LORA_SPI (harness SPI, see top[4C], mcu[1A])

### Harnesses
SPI: MOSI, MISO, CLK, NSS
EBYTE22: BUSY, RXEN, TXEN, NRST, DIO2, DIO1

### Nets
+3VLORA: C9.1 C29.1 R12.2 U6.9(VCC)
GND: C9.2 C29.2 U6.1(GND)
BUSY: U6.14(BUSY) ; port LORA.BUSY
CLK: R3.1 ; port LORA_SPI.CLK
DIO1: U6.13(DIO1) ; port LORA.DIO1
DIO2: U6.8(DIO2) ; port LORA.DIO2
MISO: U6.16(MISO) ; port LORA_SPI.MISO  [project net LORA_MISO]
MOSI: R4.1 ; port LORA_SPI.MOSI  [project net LORA_MOSI]
NRST: U6.15(NRST) ; port LORA.NRST  [project net LORA_NRST]
NSS: R12.1 U6.19(NSS) ; port LORA_SPI.NSS  [project net LORA_NSS]
RXEN: U6.6(RXEN) ; port LORA.RXEN  [project net LORA_RXEN]
TXEN: U6.7(TXEN) ; port LORA.TXEN  [project net LORA_TXEN]
NetR3_2: R3.2 U6.18(SCK)
NetR4_2: R4.2 U6.17(MOSI)

Not connected (* = marked no-connect by the designer): U6 21(ANT)*

### Notes on the sheet
- (near U6) LoRa module
- Název výkresu /drawing title/:
- Název souboru /sheet name/:
- Varianta /variant/:
- Organizace /organisation/:
- ČVUT FEL
- Kreslil /drawn by/:
- Datum /date/:
- Podpis /signature/:
- List /sheet/:
- Verze /version/:
- /
- (in symbol ECK+20u16V) 16V
- (in symbol ECK+100n16V) 16V
- (in symbol ER+10K) 0.1W 1%
- (in symbol ER+33R) 0.1W 1%

### Library data of the parts
C9 = ECK+100n16V: as C4 on sheet gps; Datasheet Link: https://connect.kemet.com:7667/gateway/IntelliData-ComponentDocumentation/1.0/download/specsheet/C0603C104K4RACTU; Height: 0.95mm; Mouser Part Number: 80-C0603C104K4RAC; Arrow Part Number: C0603C104K4RAC-TU; Arrow Price/Stock: https://www.arrow.com/en/products/c0603c104k4ractu/kemet-corporation
C29 = ECK+20u16V: Capacitor; Manufacturer_Name: Yageo Group; Manufacturer_Part_Number: C0603C200K4HACAUTO; Datasheet Link: https://www.yageogroup.com/content/datasheet/asset/file/KEM_C1007_X8R_ULTRA_150C_SMD; Height: 0.87mm; Mouser Part Number: 80-C0603C200K4HAUTO; Mouser Price/Stock: https://www.mouser.co.uk/ProductDetail/KEMET/C0603C200K4HACAUTO?qs=j%252B1pi9TdxUZOUXgrptGPiw%3D%3D; Arrow Part Number: C0603C200K4HACAUTO; Arrow Price/Stock: https://www.arrow.com/en/products/c0603c200k4hacauto/kemet-corporation?utm_currency=USD&region=nac
R3 R4 = ER+33R: as R39 on sheet top; Datasheet Link: https://datasheet.lcsc.com/lcsc/2206010116_UNI-ROYAL-Uniroyal-Elec-0603WAF330JT5E_C23140.pdf; Height: 0.55mm; Mouser Part Number: 303-0603WAF330JT5E; Mouser Price/Stock: https://www.mouser.co.uk/ProductDetail/Royalohm/0603WAF330JT5E?qs=e8oIoAS2J1RitKiKgULsBA%3D%3D
R12 = ER+10K: as R30 on sheet gps; Datasheet Link: http://www.vishay.com/docs/20035/dcrcwe3.pdf; Height: 0.5mm; Mouser Part Number: 71-CRCW0603-10K-E3; Mouser Price/Stock: https://www.mouser.co.uk/ProductDetail/Vishay-Dale/CRCW060310K0FKEA?qs=pAO1Z172M84BVnhDjtnsoQ%3D%3D; Arrow Part Number: CRCW060310K0FKEA; Arrow Price/Stock: https://www.arrow.com/en/products/crcw060310k0fkea/vishay?region=europe
U6 = EMCU+E22-900M22S: -147dBm 22.3dBm 7km SPI SMD,14x20mm LoRa Modules ROHS; pin to pad: 1>1+2+3+4+5+10+11+12+20+22

## Sheet power.SchDoc
size A4; SheetNumber: 5; SheetTotal: 6
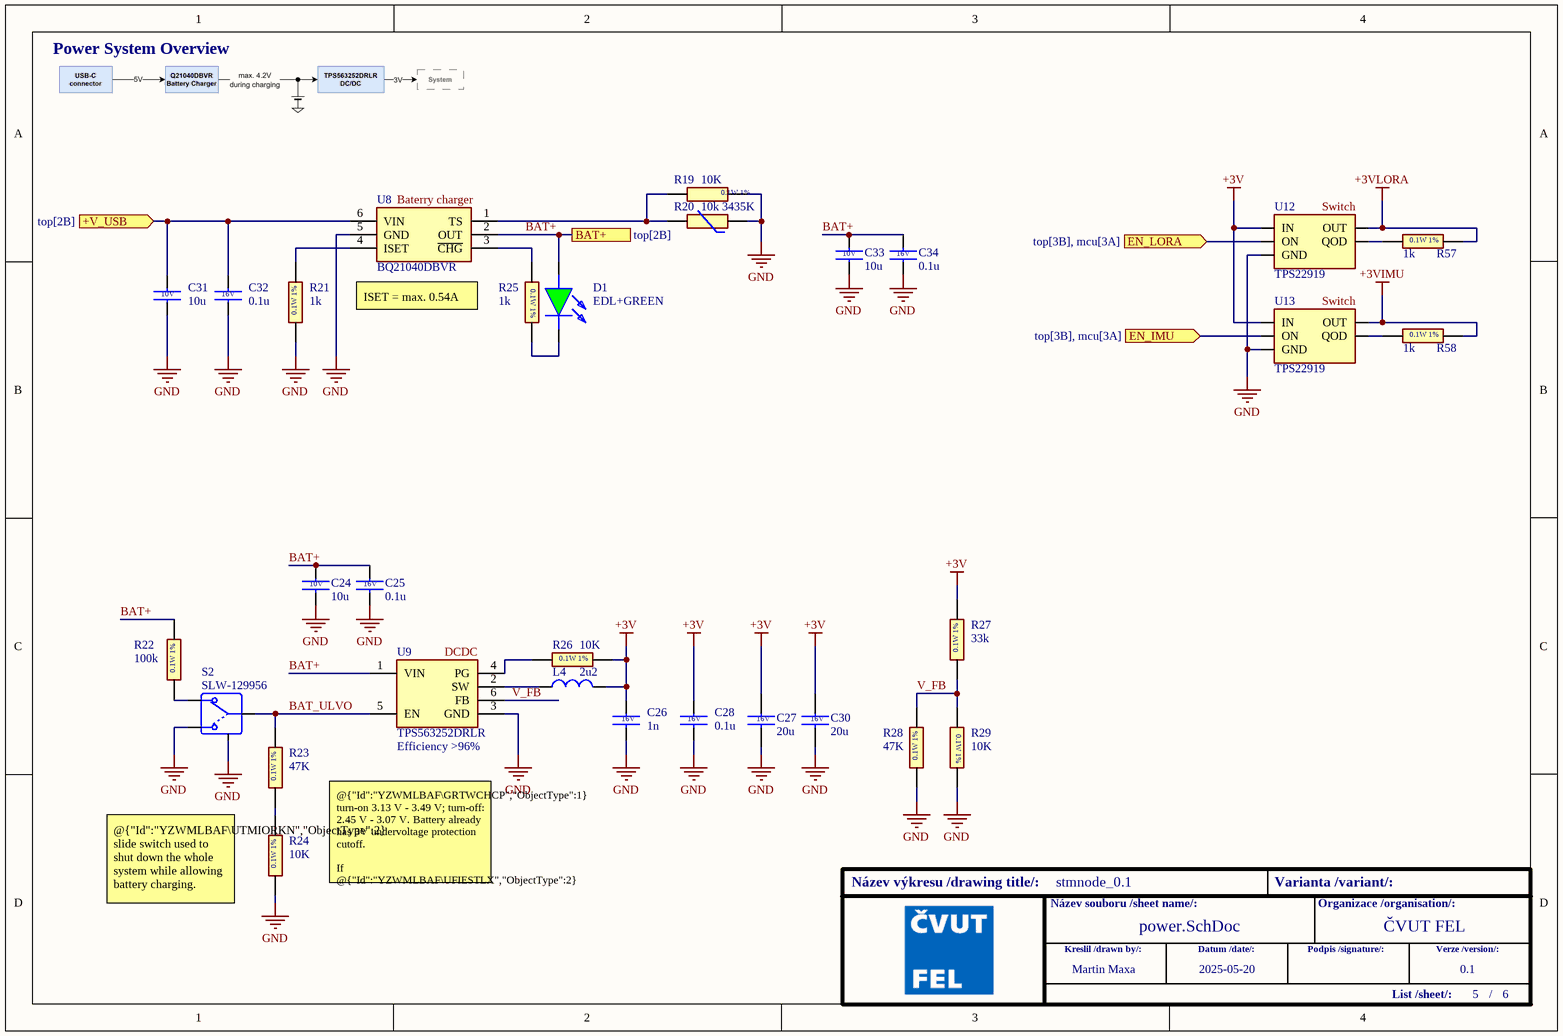
[diagram p3: power.SchDoc]

### Parts
C24  10u  [C0603]
C25  0.1u  [CAPC1608X95N]
C26  1n  [CAPC1608X87N]
C27  20u  [C0603]
C28  0.1u  [CAPC1608X95N]
C30  20u  [C0603]
C31  10u  [C0603]
C32  0.1u  [CAPC1608X95N]
C33  10u  [C0603]
C34  0.1u  [CAPC1608X95N]
D1  EDL+GREEN  [LEDM2012X80N]
L4  2u2  [INDPM5752X300N]
R19  10K  [RESC1608X50N]
R20  10k 3435K  [THRMC1608X90N]
R21  1k  [RESC1608X50N]
R22  100k  [RESC1608X55N]
R23  47K  [RESC1608X50N]
R24  10K  [RESC1608X50N]
R25  1k  [RESC1608X50N]
R26  10K  [RESC1608X50N]
R27  33k  [RESC1608X55N]
R28  47K  [RESC1608X50N]
R29  10K  [RESC1608X50N]
R57  1k  [RESC1608X50N]
R58  1k  [RESC1608X50N]
S2  SLW-129956  [SLW1299564ARAND]
U8  BQ21040DBVR  [SOT95P280X145-6N]
U9  TPS563252DRLR  [SOTFL50P160X60-6N]
U12  TPS22919  [SOT65P210X110-6N]
U13  TPS22919  [SOT65P210X110-6N]

### Ports
+V_USB (in, see top[2B]), BAT+ (see top[2B]), EN_IMU (in, see top[3B], mcu[3A]), EN_LORA (in, see top[3B], mcu[3A])

### Nets
+3V: C26.1 C27.1 C28.1 C30.1 L4.24 R26.2 R27.2 U12.1(IN) U13.1(IN)
+3VIMU: R58.2 U13.6(OUT)
+3VLORA: R57.2 U12.6(OUT)
+V_USB: C31.1 C32.1 U8.6(VIN) ; port +V_USB
GND: C24.2 C25.2 C26.2 C27.2 C28.2 C30.2 C31.2 C32.2 C33.2 C34.2 R19.1 R20.1 R21.1 R24.1 R28.1 R29.2 S2.3(NO) S2.4(MH1) U8.5(GND) U9.3(GND) U12.2(GND) U13.2(GND)
BAT+: C24.1 C25.1 C33.1 C34.1 D1.1(K) R22.2 U8.2(OUT) U9.1(VIN) ; port BAT+
BAT_ULVO: R23.2 S2.2(COM) U9.5(EN)  [project net BAT_ULVO_5]
V_FB: R27.1 R28.2 R29.1 U9.6(FB)  [project net V_FB_5]
NetD1_2: D1.2(A) R25.2
NetL4_23: L4.23 U9.2(SW)
NetR19_2: R19.2 R20.2 U8.1(TS)
NetR21_2: R21.2 U8.4(ISET)
NetR22_1: R22.1 S2.1(NO)
NetR23_1: R23.1 R24.2
NetR25_1: R25.1 U8.3(~{CHG})
NetR26_1: R26.1 U9.4(PG)
NetR57_1: R57.1 U12.5(QOD)
NetR58_1: R58.1 U13.5(QOD)
NetU4_58: U12.3(ON) ; port EN_LORA
NetU4_128: U13.3(ON) ; port EN_IMU

### Notes on the sheet
- Power System Overview
- (near U8) Baterry charger
- (near U12) Switch
- ISET = max. 0.54A
- (near U13) Switch
- (near U9) DCDC
- (near U9) Efficiency >96%
- @{"Id":"YZWMLBAF\UTMIORKN","ObjectType":2} slide switch used to shut down the whole system while allowing battery charging.
- @{"Id":"YZWMLBAF\GRTWCHCP","ObjectType":1} turn-on 3.13 V - 3.49 V; turn-off: 2.45 V - 3.07 V. Battery already has 3V undervoltage protection cutoff.
  If @{"Id":"YZWMLBAF\UFIESTLX","ObjectType":2} or @{"Id":"YZWMLBAF\HEYEGITT","ObjectType":2} NOT placed ULVO is deactivated.
- Název výkresu /drawing title/:
- Název souboru /sheet name/:
- Varianta /variant/:
- Organizace /organisation/:
- ČVUT FEL
- Kreslil /drawn by/:
- Datum /date/:
- Podpis /signature/:
- List /sheet/:
- Verze /version/:
- /
- (in symbol ECK+1n16V) 16V
- (in symbol ECK+10u10V) 10V
- (in symbol ECK+20u16V) 16V
- (in symbol ECK+100n16V) 16V
- (in symbol ER+1K) 0.1W 1%
- (in symbol ER+10K) 0.1W 1%
- (in symbol ER+33k) 0.1W 1%
- (in symbol ER+47K) 0.1W 1%
- (in symbol ER+100k) 0.1W 1%

### Library data of the parts
C24 C31 C33 = ECK+10u10V: as C3 on sheet gps; Datasheet Link: https://content.kemet.com/datasheets/KEM_C1006_X5R_SMD.pdf; Height: 0.87mm; Mouser Part Number: 80-C0603C106M8PACTU; Mouser Price/Stock: https://www.mouser.co.uk/ProductDetail/KEMET/C0603C106M8PACTU?qs=gt1LBUVyoHk6B7S%252BOYJa0A%3D%3D; Arrow Part Number: C0603C106M8PACTU; Arrow Price/Stock: https://www.arrow.com/en/products/c0603c106m8pactu/kemet-corporation?region=nac
C25 C28 C32 C34 = ECK+100n16V: as C4 on sheet gps; Datasheet Link: https://connect.kemet.com:7667/gateway/IntelliData-ComponentDocumentation/1.0/download/specsheet/C0603C104K4RACTU; Height: 0.95mm; Mouser Part Number: 80-C0603C104K4RAC; Arrow Part Number: C0603C104K4RAC-TU; Arrow Price/Stock: https://www.arrow.com/en/products/c0603c104k4ractu/kemet-corporation
C26 = ECK+1n16V: 16 VDC, 10 %, X7R; Manufacturer_Name: KEMET; Manufacturer_Part_Number: C0603C102K4RECTU; Datasheet Link: https://content.kemet.com/datasheets/KEM_C1090_X7R_ESD.pdf; Height: 0.87mm
C27 C30 = ECK+20u16V: as C29 on sheet lora; Datasheet Link: https://www.yageogroup.com/content/datasheet/asset/file/KEM_C1007_X8R_ULTRA_150C_SMD; Height: 0.87mm; Mouser Part Number: 80-C0603C200K4HAUTO; Mouser Price/Stock: https://www.mouser.co.uk/ProductDetail/KEMET/C0603C200K4HACAUTO?qs=j%252B1pi9TdxUZOUXgrptGPiw%3D%3D; Arrow Part Number: C0603C200K4HACAUTO; Arrow Price/Stock: https://www.arrow.com/en/products/c0603c200k4hacauto/kemet-corporation?utm_currency=USD&region=nac
D1 = EDL+GREEN: LED GREEN,  3.2 V; Manufacturer_Name: Wurth Elektronik; Manufacturer_Part_Number: 150080GS75000; Datasheet Link: https://katalog.we-online.com/led/datasheet/150080GS75000.pdf; Height: 0.8mm; Mouser Part Number: 710-150080GS75000; Mouser Price/Stock: https://www.mouser.co.uk/ProductDetail/Wurth-Elektronik/150080GS75000?qs=2kOmHSv6VfQRoTEZVk1mGA%3D%3D
L4 = EL+2.2u5.5A: Power Inductors - SMD 2.2uH 20%; Manufacturer_Name: Bourns; Manufacturer_Part_Number: SRP5030TA-2R2M; Datasheet Link: https://cz.mouser.com/datasheet/3/40/1/srp5030ta.pdf; Mouser Part Number: 652-SRP5030TA-2R2M; Mouser Price/Stock: https://cz.mouser.com/ProductDetail/Bourns/SRP5030TA-2R2M?qs=ZwKJWZfDtNgb6JbyacG30w%3D%3D
R19 R24 R26 R29 = ER+10K: as R30 on sheet gps; Datasheet Link: http://www.vishay.com/docs/20035/dcrcwe3.pdf; Height: 0.5mm; Mouser Part Number: 71-CRCW0603-10K-E3; Mouser Price/Stock: https://www.mouser.co.uk/ProductDetail/Vishay-Dale/CRCW060310K0FKEA?qs=pAO1Z172M84BVnhDjtnsoQ%3D%3D; Arrow Part Number: CRCW060310K0FKEA; Arrow Price/Stock: https://www.arrow.com/en/products/crcw060310k0fkea/vishay?region=europe
R20 = ER+10kNTC3435K: NTC (Negative Temperature Coefficient) Thermistors NTC,10K,1%,0603,125C,AEC-Q200,ECO; Manufacturer_Name: TDK; Manufacturer_Part_Number: NTCGS163JF103FT7; Datasheet Link: https://product.tdk.com/system/files/dam/doc/product/sensor/ntc/chip-ntc-thermistor/catalog/tpd_automotive_ntc-thermistor_ntcgs_en.pdf; Height: 0.9mm; Mouser Part Number: 810-NTCGS163JF103FT7; Mouser Price/Stock: https://www.mouser.co.uk/ProductDetail/TDK/NTCGS163JF103FT7?qs=dbcCsuKDzFUyQBb6rE%2FcrQ%3D%3D
R21 R25 R57 R58 = ER+1K: Resistor 1%, 0.1W; Manufacturer_Name: Vishay; Manufacturer_Part_Number: CRCW06031K00FKEA; Datasheet Link: http://www.vishay.com/docs/20035/dcrcwe3.pdf; Height: 0.5mm; Mouser Part Number: 71-CRCW0603-1.0K-E3; Mouser Price/Stock: https://www.mouser.co.uk/ProductDetail/Vishay-Dale/CRCW06031K00FKEA?qs=CToX950LohJasujQx7GY3g%3D%3D; Arrow Part Number: CRCW06031K00FKEA; Arrow Price/Stock: https://www.arrow.com/en/products/crcw06031k00fkea/vishay?region=europe
R22 = ER+100k: Thick Film Resistors 0603 - SMD 1/10Watt 100Kohms 1% Commercial Use; Manufacturer_Name: Yageo Group; Manufacturer_Part_Number: AC0603FR-10100KL; Datasheet Link: https://www.yageo.com/upload/media/product/productsearch/datasheet/rchip/PYu-AC_51_RoHS_L_10.pdf; Height: 0.55mm; Mouser Part Number: 603-AC0603FR-10100KL; Mouser Price/Stock: https://www.mouser.com/Search/Refine.aspx?Keyword=603-AC0603FR-10100KL
R23 R28 = ER+47K: Resistor 1%, 0.1W; Manufacturer_Name: Vishay; Manufacturer_Part_Number: CRCW060347K0FKEA; Datasheet Link: http://www.vishay.com/docs/20035/dcrcwe3.pdf; Height: 0.5mm; Mouser Part Number: 71-CRCW0603-47K-E3; Mouser Price/Stock: https://www.mouser.co.uk/ProductDetail/Vishay-Dale/CRCW060347K0FKEA?qs=yJVtgANCw03gcaACf6JZKA%3D%3D; Arrow Part Number: CRCW060347K0FKEA; Arrow Price/Stock: https://www.arrow.com/en/products/crcw060347k0fkea/vishay?region=nac
R27 = ER+33k: Thick Film Resistors - SMD General Purpose Chip Resistor 0603, 33kOhms, 1%, 1/10W; Manufacturer_Name: Yageo Group; Manufacturer_Part_Number: RC0603FR-1333KL; Datasheet Link: http://www.yageo.com/documents/recent/PYu-RC0603_51_RoHS_L_v5.pdf; Height: 0.55mm; Mouser Part Number: 603-RC0603FR-1333KL; Mouser Price/Stock: https://www.mouser.co.uk/ProductDetail/Yageo/RC0603FR-1333KL?qs=IuGqVx9wL0LwIipsoMfsXg%3D%3D
S2 = ESW-SLW-129956: Slide Switch, Right Angle, max. 50 VDC, max. 300 mA, ON - ON; pin to pad: 4>4+5; Manufacturer_Name: Same Sky; Manufacturer_Part_Number: SLW-129956-4A-RA-N-D; Datasheet Link: https://www.sameskydevices.com/product/resource/slw-129956-4a-ra-n-d.pdf; Height: 6.3mm; Mouser Part Number: 179-SLW1299564ARAND; Mouser Price/Stock: https://www.mouser.co.uk/ProductDetail/Same-Sky/SLW-129956-4A-RA-N-D?qs=IKkN%2F947nfAoCoaoyLYE3A%3D%3D
U8 = EU+BQ21040DBVR: Battery Management 1-cell 0.8-A Li-ion and Li-polymer batt A 595-BQ21040DBVT; Manufacturer_Name: Texas Instruments; Datasheet Link: http://www.ti.com/lit/gpn/bq21040; Height: 1.45mm; Manufacturer_Part_Number: BQ21040DBVR; Mouser Part Number: 595-BQ21040DBVR; Mouser Price/Stock: https://www.mouser.co.uk/ProductDetail/Texas-Instruments/BQ21040DBVR?qs=cttFivMKqWyovUuY6Xwwcw%3D%3D; Arrow Part Number: BQ21040DBVR; Arrow Price/Stock: https://www.arrow.com/en/products/bq21040dbvr/texas-instruments?utm_currency=USD&region=nac
U9 = EU+TPS563252DRLR: Switching Voltage Regulators 3-V to 17-V input vo ltage 3-A 1.2-Mhz; Manufacturer_Name: Texas Instruments; Datasheet Link: https://www.ti.com/lit/ds/symlink/tps563252.pdf?ts=1715244064437&ref_url=https%253A%252F%252Fwww.mouser.in%252F; Height: 0.6mm; Manufacturer_Part_Number: TPS563252DRLR; Mouser Part Number: 595-TPS563252DRLR; Mouser Price/Stock: https://www.mouser.co.uk/ProductDetail/Texas-Instruments/TPS563252DRLR?qs=ulEaXIWI0c%252BIcG7y3AlP5A%3D%3D; Arrow Part Number: TPS563252DRLR; Arrow Price/Stock: https://www.arrow.com/en/products/tps563252drlr/texas-instruments?utm_currency=USD&region=nac
U12 U13 = EU+TPS22919: Power Switch ICs - Power Distribution 1-ch 5.5V 1.5A 90 mOhm self-protected AE; Manufacturer_Name: Texas Instruments; Manufacturer_Part_Number: TPS22919QDCKRQ1; Datasheet Link: https://www.ti.com/lit/gpn/tps22919-q1; Height: 1.1mm; Mouser Part Number: 595-TPS22919QDCKRQ1; Mouser Price/Stock: https://cz.mouser.com/ProductDetail/Texas-Instruments/TPS22919QDCKRQ1?qs=sGAEpiMZZMvjbjwkTuU2aX%252BB0PF2SxcjkwPe0jmTNxcgLPqTFcsPcA%3D%3D

## Sheet mcu.SchDoc
size A3; SheetNumber: 2; SheetTotal: 8
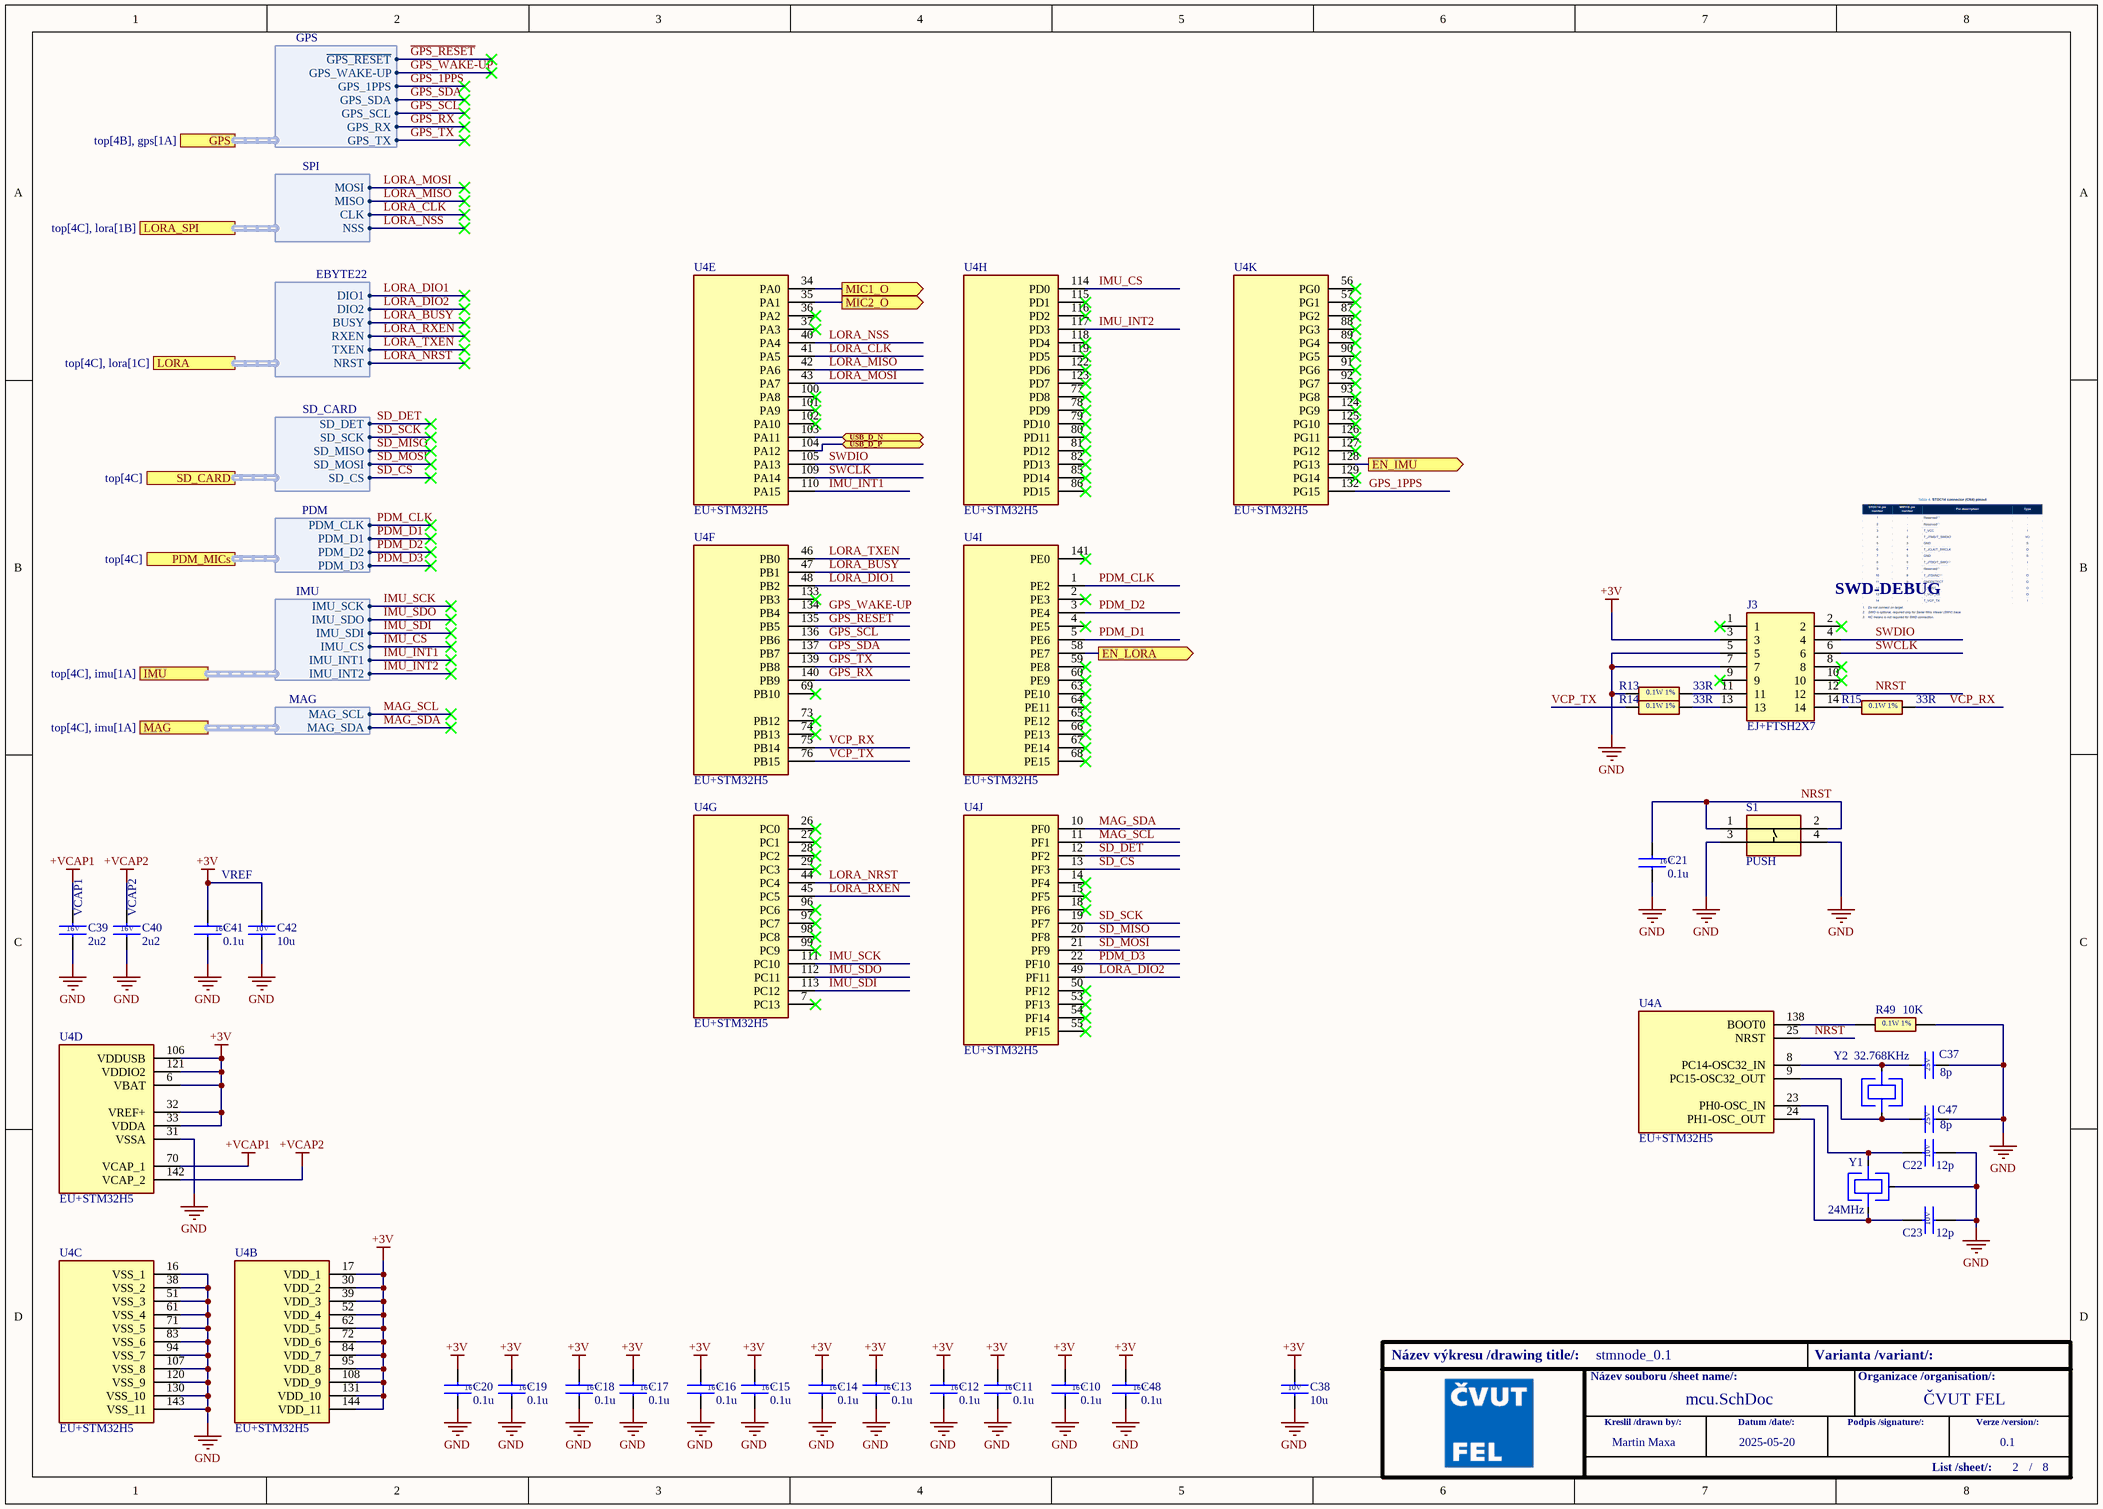
[diagram p4: mcu.SchDoc]

### Parts
(Parts that share a designator on the sheet are numbered #1, #2 ... from top to bottom, then left to right.)
C10  0.1u  [CAPC1608X95N]
C11  0.1u  [CAPC1608X95N]
C12  0.1u  [CAPC1608X95N]
C13  0.1u  [CAPC1608X95N]
C14  0.1u  [CAPC1608X95N]
C15  0.1u  [CAPC1608X95N]
C16  0.1u  [CAPC1608X95N]
C17  0.1u  [CAPC1608X95N]
C18  0.1u  [CAPC1608X95N]
C19  0.1u  [CAPC1608X95N]
C20  0.1u  [CAPC1608X95N]
C21  0.1u  [CAPC1608X95N]
C22  12p  [CAPC1608X97N]
C23  12p  [CAPC1608X97N]
C37#2  8p  [CBR04C160F5GAC]
C38  10u  [C0603]
C39  2u2  [CAPC1608X90N]
C40  2u2  [CAPC1608X90N]
C41  0.1u  [CAPC1608X95N]
C42  10u  [C0603]
C47  8p  [CBR04C160F5GAC]
C48  0.1u  [CAPC1608X95N]
J3  EJ+FTSH2X7  [FTSH-107-XX-YYY-DV-K-A-P]
R13  33R  [RESC1608X55N]
R14  33R  [RESC1608X55N]
R15  33R  [RESC1608X55N]
R49  10K  [RESC1608X50N]
S1  PUSH  [RKB2SJM250SMTRLFS]
U4  EU+STM32H5  [QFP50P2200X2200X160-144N]  (parts A,B,C,D,E,F,G,H,I,J,K of 11)
Y1  24MHz  [830107006509]
Y2  32.768KHz  [830009709]

### Ports
EN_IMU (out, see top[4B], power[3B]), EN_LORA (out, see top[4B], power[3A]), GPS (harness GPS, see top[4B], gps[1A]), IMU (harness IMU, see top[4C], imu[1A]), LORA (harness EBYTE22, see top[4C], lora[1C]), LORA_SPI (harness SPI, see top[4C], lora[1B]), MAG (harness MAG, see top[4C], imu[1A]), MIC1_O (out, see top[4C], analog_mics[3B]), MIC2_O (out, see top[4C], analog_mics[3C]), PDM_MICs (harness PDM, see top[4C]), SD_CARD (harness SD_CARD, see top[4C]), USB_D_N (bidir, see top[4B]), USB_D_P (bidir, see top[4B])

### Harnesses
SPI: MOSI, MISO, CLK, NSS
EBYTE22: BUSY, RXEN, TXEN, NRST, DIO2, DIO1
GPS: GPS_TX, GPS_RX, GPS_SCL, GPS_SDA, GPS_1PPS, GPS_WAKE-UP, ~{GPS_RESET}
SD_CARD: SD_CS, SD_MOSI, SD_SCK, SD_DET, SD_MISO
PDM: PDM_D3, PDM_D2, PDM_D1, PDM_CLK
IMU: IMU_INT2, IMU_INT1, IMU_CS, IMU_SDI, IMU_SDO, IMU_SCK
MAG: MAG_SCL, MAG_SDA

### Nets
+3V: C10.1 C11.1 C12.1 C13.1 C14.1 C15.1 C16.1 C17.1 C18.1 C19.1 C20.1 C38.1 C41.1 C42.1 C48.1 J3.3 U4.6(VBAT) U4.17(VDD_1) U4.30(VDD_2) U4.32(VREF+) U4.33(VDDA) U4.39(VDD_3) U4.52(VDD_4) U4.62(VDD_5) U4.72(VDD_6) U4.84(VDD_7) U4.95(VDD_8) U4.106(VDDUSB) U4.108(VDD_9) U4.121(VDDIO2) U4.131(VDD_10) U4.144(VDD_11)
+VCAP1: C39.1 U4.70(VCAP_1)
+VCAP2: C40.1 U4.142(VCAP_2)
GND: C10.2 C11.2 C12.2 C13.2 C14.2 C15.2 C16.2 C17.2 C18.2 C19.2 C20.2 C21.2 C22.2 C23.2 C37#2.2 C38.2 C39.2 C40.2 C41.2 C42.2 C47.2 C48.2 J3.5 J3.7 R13.1 R49.2 S1.3(COM) S1.4(COM_2) U4.16(VSS_1) U4.31(VSSA) U4.38(VSS_2) U4.51(VSS_3) U4.61(VSS_4) U4.71(VSS_5) U4.83(VSS_6) U4.94(VSS_7) U4.107(VSS_8) U4.120(VSS_9) U4.130(VSS_10) U4.143(VSS_11) Y1.2(GND)
~{GPS_RESET}: U4.135(PB5) ; port GPS.~{GPS_RESET}
GPS_1PPS: U4.132(PG15) ; port GPS.GPS_1PPS  [project net 1PPS]
GPS_RX: U4.140(PB9) ; port GPS.GPS_RX
GPS_SCL: U4.136(PB6) ; port GPS.GPS_SCL
GPS_SDA: U4.137(PB7) ; port GPS.GPS_SDA
GPS_TX: U4.139(PB8) ; port GPS.GPS_TX
GPS_WAKE-UP: U4.134(PB4) ; port GPS.GPS_WAKE-UP
IMU_CS: U4.114(PD0) ; port IMU.IMU_CS
IMU_INT1: U4.110(PA15) ; port IMU.IMU_INT1
IMU_INT2: U4.117(PD3) ; port IMU.IMU_INT2
IMU_SCK: U4.111(PC10) ; port IMU.IMU_SCK
IMU_SDI: U4.113(PC12) ; port IMU.IMU_SDI
IMU_SDO: U4.112(PC11) ; port IMU.IMU_SDO
LORA_BUSY: U4.47(PB1) ; port LORA.BUSY  [project net BUSY]
LORA_CLK: U4.41(PA5) ; port LORA_SPI.CLK  [project net CLK]
LORA_DIO1: U4.48(PB2) ; port LORA.DIO1  [project net DIO1]
LORA_DIO2: U4.49(PF11) ; port LORA.DIO2  [project net DIO2]
LORA_MISO: U4.42(PA6) ; port LORA_SPI.MISO
LORA_MOSI: U4.43(PA7) ; port LORA_SPI.MOSI
LORA_NRST: U4.44(PC4) ; port LORA.NRST
LORA_NSS: U4.40(PA4) ; port LORA_SPI.NSS
LORA_RXEN: U4.45(PC5) ; port LORA.RXEN
LORA_TXEN: U4.46(PB0) ; port LORA.TXEN
MAG_SCL: U4.11(PF1) ; port MAG.MAG_SCL
MAG_SDA: U4.10(PF0) ; port MAG.MAG_SDA
NRST: C21.1 J3.12 S1.1(NO_1) S1.2(NO_2) U4.25(NRST)  [project net NRST_2]
PDM_CLK: U4.1(PE2) ; port PDM_MICs.PDM_CLK
PDM_D1: U4.5(PE6) ; port PDM_MICs.PDM_D1
PDM_D2: U4.3(PE4) ; port PDM_MICs.PDM_D2
PDM_D3: U4.22(PF10) ; port PDM_MICs.PDM_D3
SD_CS: U4.13(PF3) ; port SD_CARD.SD_CS
SD_DET: U4.12(PF2) ; port SD_CARD.SD_DET
SD_MISO: U4.20(PF8) ; port SD_CARD.SD_MISO
SD_MOSI: U4.21(PF9) ; port SD_CARD.SD_MOSI
SD_SCK: U4.19(PF7) ; port SD_CARD.SD_SCK
SWCLK: J3.6 U4.109(PA14)  [project net SWCLK_2]
SWDIO: J3.4 U4.105(PA13)  [project net SWDIO_2]
USB_D_N: U4.103(PA11) ; port USB_D_N
USB_D_P: U4.104(PA12) ; port USB_D_P
VCP_RX: R15.2 U4.75(PB14)  [project net VCP_RX_2]
VCP_TX: R14.1 U4.76(PB15)  [project net VCP_TX_2]
NetC22_1: C22.1 U4.23(PH0-OSC_IN) Y1.3(CRYSTAL_2)
NetC23_1: C23.1 U4.24(PH1-OSC_OUT) Y1.1(CRYSTAL_1)
NetC37#2_1: C37#2.1 U4.8(PC14-OSC32_IN) Y2.2(CRYSTAL_2)
NetC47_1: C47.1 U4.9(PC15-OSC32_OUT) Y2.1(CRYSTAL_1)
NetJ3_11: J3.11 R13.2
NetJ3_13: J3.13 R14.2
NetJ3_14: J3.14 R15.1
NetR49_1: R49.1 U4.138(BOOT0)
NetU4_34: U4.34(PA0) ; port MIC1_O
NetU4_35: U4.35(PA1) ; port MIC2_O
NetU4_58: U4.58(PE7) ; port EN_LORA
NetU4_128: U4.128(PG13) ; port EN_IMU

Not connected (* = marked no-connect by the designer): J3 1* 2* 8* 9* 10*; U4 2(PE3)* 4(PE5)* 7(PC13)* 14(PF4)* 15(PF5)* 18(PF6)* 26(PC0)* 27(PC1)* 28(PC2)* 29(PC3)* 36(PA2)* 37(PA3)* 50(PF12)* 53(PF13)* 54(PF14)* 55(PF15)* 56(PG0)* 57(PG1)* 59(PE8)* 60(PE9)* 63(PE10)* 64(PE11)* 65(PE12)* 66(PE13)* 67(PE14)* 68(PE15)* 69(PB10)* 73(PB12)* 74(PB13)* 77(PD8)* 78(PD9)* 79(PD10)* 80(PD11)* 81(PD12)* 82(PD13)* 85(PD14)* 86(PD15)* 87(PG2)* 88(PG3)* 89(PG4)* 90(PG5)* 91(PG6)* 92(PG7)* 93(PG8)* 96(PC6)* 97(PC7)* 98(PC8)* 99(PC9)* 100(PA8)* 101(PA9)* 102(PA10)* 115(PD1)* 116(PD2)* 118(PD4)* 119(PD5)* 122(PD6)* 123(PD7)* 124(PG9)* 125(PG10)* 126(PG11)* 127(PG12)* 129(PG14)* 133(PB3)* 141(PE0)*

### Notes on the sheet
- (near J3) SWD-DEBUG
- (near C39) VCAP1
- (near C40) VCAP2
- VREF
- Název výkresu /drawing title/:
- Název souboru /sheet name/:
- Varianta /variant/:
- Organizace /organisation/:
- ČVUT FEL
- Kreslil /drawn by/:
- Datum /date/:
- Podpis /signature/:
- List /sheet/:
- Verze /version/:
- /
- (in symbol ECK+2.2u16V) 16V
- (in symbol ECK+8p25V_0402) 25V
- (in symbol ECK+10u10V) 10V
- (in symbol ECK+12p10V) 10V
- (in symbol ECK+100n16V) 16V
- (in symbol ER+10K) 0.1W 1%
- (in symbol ER+33R) 0.1W 1%

### Library data of the parts
C10-C21 C41 C48 = ECK+100n16V: as C4 on sheet gps; Datasheet Link: https://connect.kemet.com:7667/gateway/IntelliData-ComponentDocumentation/1.0/download/specsheet/C0603C104K4RACTU; Height: 0.95mm; Mouser Part Number: 80-C0603C104K4RAC; Arrow Part Number: C0603C104K4RAC-TU; Arrow Price/Stock: https://www.arrow.com/en/products/c0603c104k4ractu/kemet-corporation
C22 C23 = ECK+12p10V: as C35 on sheet gps; Datasheet Link: https://www.vishay.com/docs/45199/vjcommercialseries.pdf; Height: 0.97mm; Mouser Part Number: 77-VJ0603A120FXQCBC; Mouser Price/Stock: https://www.mouser.com/Search/Refine.aspx?Keyword=77-VJ0603A120FXQCBC; Arrow Part Number: VJ0603A120FXQCW1BC; Arrow Price/Stock: https://www.arrow.com/en/products/vj0603a120fxqcw1bc/vishay
C37#2 C47 = ECK+8p25V_0402: 25V 8pF C0G 0402 0.25pF; Manufacturer_Name: Yageo Group; Manufacturer_Part_Number: CBR04C809C3GAC; Datasheet Link: https://www.yageogroup.com/content/datasheet/asset/file/KEM_C1030_CBR_SMD; Height: 0.55mm; Mouser Part Number: 80-CBR04C809C3GAC; Mouser Price/Stock: https://www.mouser.co.uk/ProductDetail/KEMET/CBR04C809C3GAC?qs=kpVq%2FgIAs53vwZ%252BGNvfyMA%3D%3D; Arrow Part Number: CBR04C809C3GAC; Arrow Price/Stock: https://www.arrow.com/en/products/cbr04c809c3gac/kemet-corporation?region=nac
C38 C42 = ECK+10u10V: as C3 on sheet gps; Datasheet Link: https://content.kemet.com/datasheets/KEM_C1006_X5R_SMD.pdf; Height: 0.87mm; Mouser Part Number: 80-C0603C106M8PACTU; Mouser Price/Stock: https://www.mouser.co.uk/ProductDetail/KEMET/C0603C106M8PACTU?qs=gt1LBUVyoHk6B7S%252BOYJa0A%3D%3D; Arrow Part Number: C0603C106M8PACTU; Arrow Price/Stock: https://www.arrow.com/en/products/c0603c106m8pactu/kemet-corporation?region=nac
C39 C40 = ECK+2.2u16V: Multilayer Ceramic Capacitors MLCC - SMD/SMT 2.2 uF 16 VDC 10% 0603 X6S; Manufacturer_Name: Murata Electronics; Manufacturer_Part_Number: GRM188C81C225KA12D; Datasheet Link: https://search.murata.co.jp/Ceramy/image/img/A01X/G101/ENG/GRM188C81C225KA12-04A.pdf; Height: 0.9mm; Mouser Part Number: 81-GRM188C81C225KA2D; Mouser Price/Stock: https://www.mouser.co.uk/ProductDetail/Murata-Electronics/GRM188C81C225KA12D?qs=O5cugoO6nwevZQeqg2lgHQ%3D%3D; Arrow Part Number: GRM188C81C225KA12D; Arrow Price/Stock: https://www.arrow.com/en/products/grm188c81c225ka12d/murata-manufacturing?utm_currency=USD&region=nac
J3 = EJ+FTSH2X7: Connector; Manufacturer_Name: SAMTEC; Manufacturer_Part_Number: FTSH-107-01-L-DV-K-A-P; Datasheet Link: http://suddendocs.samtec.com/prints/ftsh-1xx-xx-xxx-dv-xxx-xxx-mkt.pdf; Mouser Part Number: 200-FTSH10701LDVKAP; Mouser Price/Stock: https://www.mouser.co.uk/ProductDetail/Samtec/FTSH-107-01-L-DV-K-A-P?qs=PB6%2FjmICvI2QizANfiVr3Q%3D%3D; Arrow Part Number: FTSH-107-01-L-DV-K-A-P; Arrow Price/Stock: https://www.arrow.com/en/products/ftsh-107-01-l-dv-k-a-p/samtec?region=nac
R13-R15 = ER+33R: as R39 on sheet top; Datasheet Link: https://datasheet.lcsc.com/lcsc/2206010116_UNI-ROYAL-Uniroyal-Elec-0603WAF330JT5E_C23140.pdf; Height: 0.55mm; Mouser Part Number: 303-0603WAF330JT5E; Mouser Price/Stock: https://www.mouser.co.uk/ProductDetail/Royalohm/0603WAF330JT5E?qs=e8oIoAS2J1RitKiKgULsBA%3D%3D
R49 = ER+10K: as R30 on sheet gps; Datasheet Link: http://www.vishay.com/docs/20035/dcrcwe3.pdf; Height: 0.5mm; Mouser Part Number: 71-CRCW0603-10K-E3; Mouser Price/Stock: https://www.mouser.co.uk/ProductDetail/Vishay-Dale/CRCW060310K0FKEA?qs=pAO1Z172M84BVnhDjtnsoQ%3D%3D; Arrow Part Number: CRCW060310K0FKEA; Arrow Price/Stock: https://www.arrow.com/en/products/crcw060310k0fkea/vishay?region=europe
S1 = EB+PUSH2: Small Tact Switch; Manufacturer_Name: C & K COMPONENTS; Manufacturer_Part_Number: RKB2SJM250SMTR LFS; Datasheet Link: https://www.ckswitches.com/media/3130/ck_rk_datasheet.pdf; Height: 2.7mm; Mouser Part Number: 611-RKB2SJM250SMTRLF; Mouser Price/Stock: https://www.mouser.co.uk/ProductDetail/CK/RKB2SJM250SMTR-LFS?qs=iLbezkQI%252Bsj518EgFgehgw%3D%3D; Arrow Part Number: RKB2SJM250SMTR LFS; Arrow Price/Stock: null?region=nac
U4 = EU+STM32H5: STM32H563ZIT6; Manufacturer_Name: STMicroelectronics; Datasheet Link: https://www.st.com/resource/en/datasheet/stm32h562ag.pdf; Height: 1.6mm; Manufacturer_Part_Number: STM32H563ZIT6; Mouser Part Number: 511-STM32H563ZIT6; Mouser Price/Stock: https://www.mouser.co.uk/ProductDetail/STMicroelectronics/STM32H563ZIT6?qs=amGC7iS6iy9kqsV9OIos2w%3D%3D; Arrow Part Number: STM32H563ZIT6; Arrow Price/Stock: https://www.arrow.com/en/products/stm32h563zit6/stmicroelectronics?utm_currency=USD&region=nac
Y1 = ECR+24MHZ: Crystals WE-XTAL 24.0MHz 15ppm 3.2 x 2.5mm; pin to pad: 2>2+4; Manufacturer_Name: Wurth Elektronik; Datasheet Link: https://www.we-online.com/catalog/datasheet/830107006509.pdf; Height: 0.8mm; Manufacturer_Part_Number: 830107006509; Mouser Part Number: 710-830107006509; Mouser Price/Stock: https://www.mouser.co.uk/ProductDetail/Wurth-Elektronik/830107006509?qs=hWgE7mdIu5QkYkvr4tcl2g%3D%3D
Y2 = ECR+32.768KHz: Crystals WE-XTAL 32.768 kHz 7pF 70kOhms; Manufacturer_Name: Wurth Elektronik; Datasheet Link: https://www.we-online.com/catalog/datasheet/830009709.pdf; Height: 0.9mm; Manufacturer_Part_Number: 830009709; Mouser Part Number: 710-830009709; Mouser Price/Stock: https://www.mouser.co.uk/ProductDetail/Wurth-Elektronik/830009709?qs=2WXlatMagcG5opfa%252B%2FO2MQ%3D%3D

## Sheet imu.SchDoc
size A4; SheetNumber: 6; SheetTotal: 8
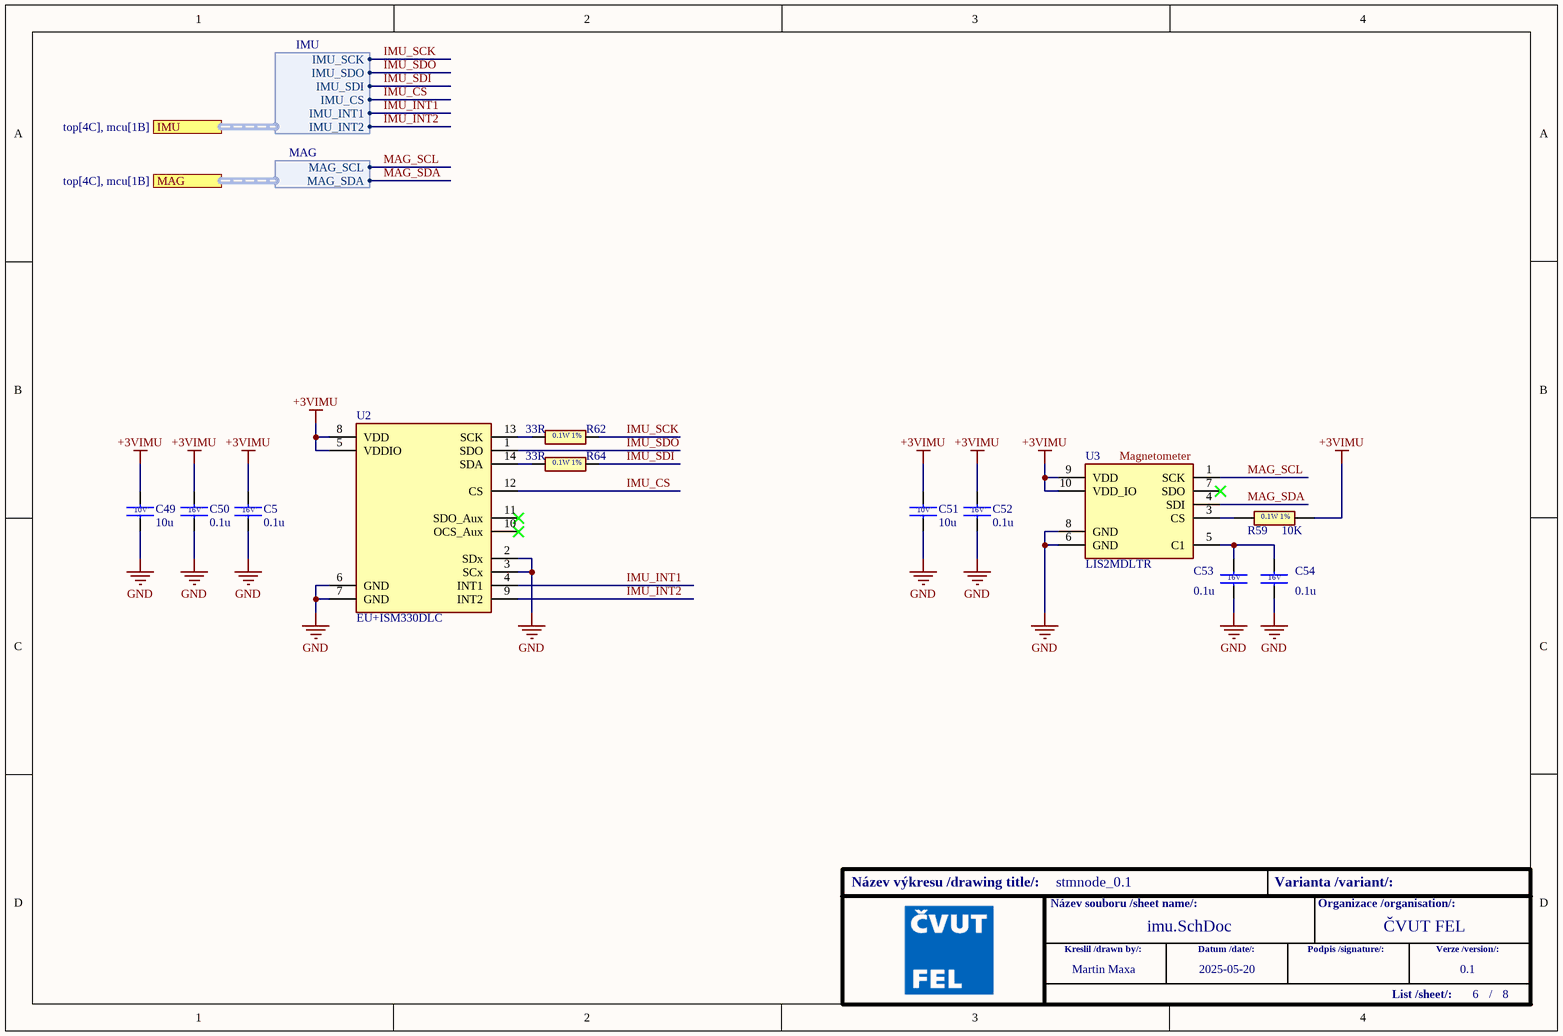
[diagram p5: imu.SchDoc]

### Parts
(Parts that share a designator on the sheet are numbered #1, #2 ... from top to bottom, then left to right.)
C5#2  0.1u  [CAPC1608X95N]
C49  10u  [C0603]
C50  0.1u  [CAPC1608X95N]
C51  10u  [C0603]
C52  0.1u  [CAPC1608X95N]
C53  0.1u  [CAPC1608X95N]
C54  0.1u  [CAPC1608X95N]
R59  10K  [RESC1608X50N]
R62  33R  [RESC1608X55N]
R64  33R  [RESC1608X55N]
U2  EU+ISM330DLC  [LGA-14_1]
U3  LIS2MDLTR  [LGA-12]

### Ports
IMU (harness IMU, see top[4C], mcu[1B]), MAG (harness MAG, see top[4C], mcu[1B])

### Harnesses
IMU: IMU_INT2, IMU_INT1, IMU_CS, IMU_SDI, IMU_SDO, IMU_SCK
MAG: MAG_SCL, MAG_SDA

### Nets
+3VIMU: C5#2.1 C49.1 C50.1 C51.1 C52.1 R59.2 U2.5(VDDIO) U2.8(VDD) U3.9(VDD) U3.10(VDD_IO)
GND: C5#2.2 C49.2 C50.2 C51.2 C52.2 C53.2 C54.2 U2.2(SDx) U2.3(SCx) U2.6(GND) U2.7(GND) U3.6(GND) U3.8(GND)
IMU_CS: U2.12(CS) ; port IMU.IMU_CS
IMU_INT1: U2.4(INT1) ; port IMU.IMU_INT1
IMU_INT2: U2.9(INT2) ; port IMU.IMU_INT2
IMU_SCK: R62.2 ; port IMU.IMU_SCK
IMU_SDI: R64.2 ; port IMU.IMU_SDI
IMU_SDO: U2.1(SDO) ; port IMU.IMU_SDO
MAG_SCL: U3.1(SCK) ; port MAG.MAG_SCL
MAG_SDA: U3.4(SDI) ; port MAG.MAG_SDA
NetC53_1: C53.1 C54.1 U3.5(C1)
NetR59_1: R59.1 U3.3(CS)
NetR62_1: R62.1 U2.13(SCK)
NetR64_1: R64.1 U2.14(SDA)

Not connected (* = marked no-connect by the designer): U2 10(OCS_Aux)* 11(SDO_Aux)*; U3 7(SDO)*

### Notes on the sheet
- (near U3) Magnetometer
- Název výkresu /drawing title/:
- Název souboru /sheet name/:
- Varianta /variant/:
- Organizace /organisation/:
- ČVUT FEL
- Kreslil /drawn by/:
- Datum /date/:
- Podpis /signature/:
- List /sheet/:
- Verze /version/:
- /
- (in symbol ECK+10u10V) 10V
- (in symbol ECK+100n16V) 16V
- (in symbol ER+10K) 0.1W 1%
- (in symbol ER+33R) 0.1W 1%

### Library data of the parts
C5#2 C50 C52-C54 = ECK+100n16V: as C4 on sheet gps; Datasheet Link: https://connect.kemet.com:7667/gateway/IntelliData-ComponentDocumentation/1.0/download/specsheet/C0603C104K4RACTU; Height: 0.95mm; Mouser Part Number: 80-C0603C104K4RAC; Arrow Part Number: C0603C104K4RAC-TU; Arrow Price/Stock: https://www.arrow.com/en/products/c0603c104k4ractu/kemet-corporation
C49 C51 = ECK+10u10V: as C3 on sheet gps; Datasheet Link: https://content.kemet.com/datasheets/KEM_C1006_X5R_SMD.pdf; Height: 0.87mm; Mouser Part Number: 80-C0603C106M8PACTU; Mouser Price/Stock: https://www.mouser.co.uk/ProductDetail/KEMET/C0603C106M8PACTU?qs=gt1LBUVyoHk6B7S%252BOYJa0A%3D%3D; Arrow Part Number: C0603C106M8PACTU; Arrow Price/Stock: https://www.arrow.com/en/products/c0603c106m8pactu/kemet-corporation?region=nac
R59 = ER+10K: as R30 on sheet gps; Datasheet Link: http://www.vishay.com/docs/20035/dcrcwe3.pdf; Height: 0.5mm; Mouser Part Number: 71-CRCW0603-10K-E3; Mouser Price/Stock: https://www.mouser.co.uk/ProductDetail/Vishay-Dale/CRCW060310K0FKEA?qs=pAO1Z172M84BVnhDjtnsoQ%3D%3D; Arrow Part Number: CRCW060310K0FKEA; Arrow Price/Stock: https://www.arrow.com/en/products/crcw060310k0fkea/vishay?region=europe
R62 R64 = ER+33R: as R39 on sheet top; Datasheet Link: https://datasheet.lcsc.com/lcsc/2206010116_UNI-ROYAL-Uniroyal-Elec-0603WAF330JT5E_C23140.pdf; Height: 0.55mm; Mouser Part Number: 303-0603WAF330JT5E; Mouser Price/Stock: https://www.mouser.co.uk/ProductDetail/Royalohm/0603WAF330JT5E?qs=e8oIoAS2J1RitKiKgULsBA%3D%3D
U2 = EU+ISM330DLC: ISM330DLCTR iNEMO 6-axis IMU: 3-axis accelerometer and 3-axis gyroscope with digital output; Manufacturer_Name: STMicroelectronics; Datasheet Link: https://www.st.com/resource/en/datasheet/ism330dlc.pdf; Manufacturer_Part_Number: ISM330DLCTR; Mouser Part Number: 511-ISM330DLCTR; Mouser Price/Stock: https://www.mouser.co.uk/ProductDetail/STMicroelectronics/ISM330DLCTR?qs=HXFqYaX1Q2xJsRh9qTmUlw%3D%3D; Arrow Part Number: ISM330DLCTR; Arrow Price/Stock: https://www.arrow.com/en/products/ism330dlctr/stmicroelectronics.html?utm_currency=USD&region=nac
U3 = EU+LIS2MDLTR: Magnetic Sensors Digital output magnetic sensor: ultralow-power, high-performance 3-axis magnetom; Manufacturer_Name: STMicroelectronics; Datasheet Link: https://www.st.com/resource/en/datasheet/lis2mdl.pdf; Manufacturer_Part_Number: LIS2MDLTR; Mouser Part Number: 511-LIS2MDLTR; Mouser Price/Stock: https://www.mouser.co.uk/ProductDetail/STMicroelectronics/LIS2MDLTR?qs=5aG0NVq1C4wS0n6b5NiBNQ%3D%3D; Arrow Part Number: LIS2MDLTR; Arrow Price/Stock: https://www.arrow.com/en/products/lis2mdltr/stmicroelectronics?utm_currency=USD&region=nac

## Sheet project_info.SchDoc
size A4; SheetNumber: 8; SheetTotal: 8
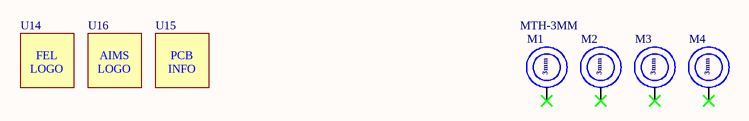
[diagram p6: project_info.SchDoc]

### Parts
M1  MTH-3MM  [MountingHole_3.0mm_NPTH]
M2  MTH-3MM  [MountingHole_3.0mm_NPTH]  (value not drawn)
M3  MTH-3MM  [MountingHole_3.0mm_NPTH]  (value not drawn)
M4  MTH-3MM  [MountingHole_3.0mm_NPTH]  (value not drawn)
U14  SYM+FEL_LOGO  [FEL_LOGO_MED]  (value not drawn)
U15  SYM+PCB_INFO  [PCB_INFO]  (value not drawn)
U16  SYM+AIMS_LOGO  [AIMS_LOGO]  (value not drawn)

### Nets

Not connected (* = marked no-connect by the designer): M1 1*; M2 1*; M3 1*; M4 1*

### Notes on the sheet
- Název výkresu /drawing title/:
- Název souboru /sheet name/:
- Varianta /variant/:
- Organizace /organisation/:
- ČVUT FEL
- Kreslil /drawn by/:
- Datum /date/:
- Podpis /signature/:
- List /sheet/:
- Verze /version/:
- /
- (in symbol EMECH-MTH-3MM) 3mm
- (in symbol SYM+AIMS_LOGO) AIMS / LOGO
- (in symbol SYM+FEL_LOGO) FEL / LOGO
- (in symbol SYM+PCB_INFO) PCB / INFO

### Library data of the parts
M1-M4 = EMECH-MTH-3MM